# Altium schematic sheet moteus_n1.SchDoc
size 1051 x 725 mm; Origin: Eagle
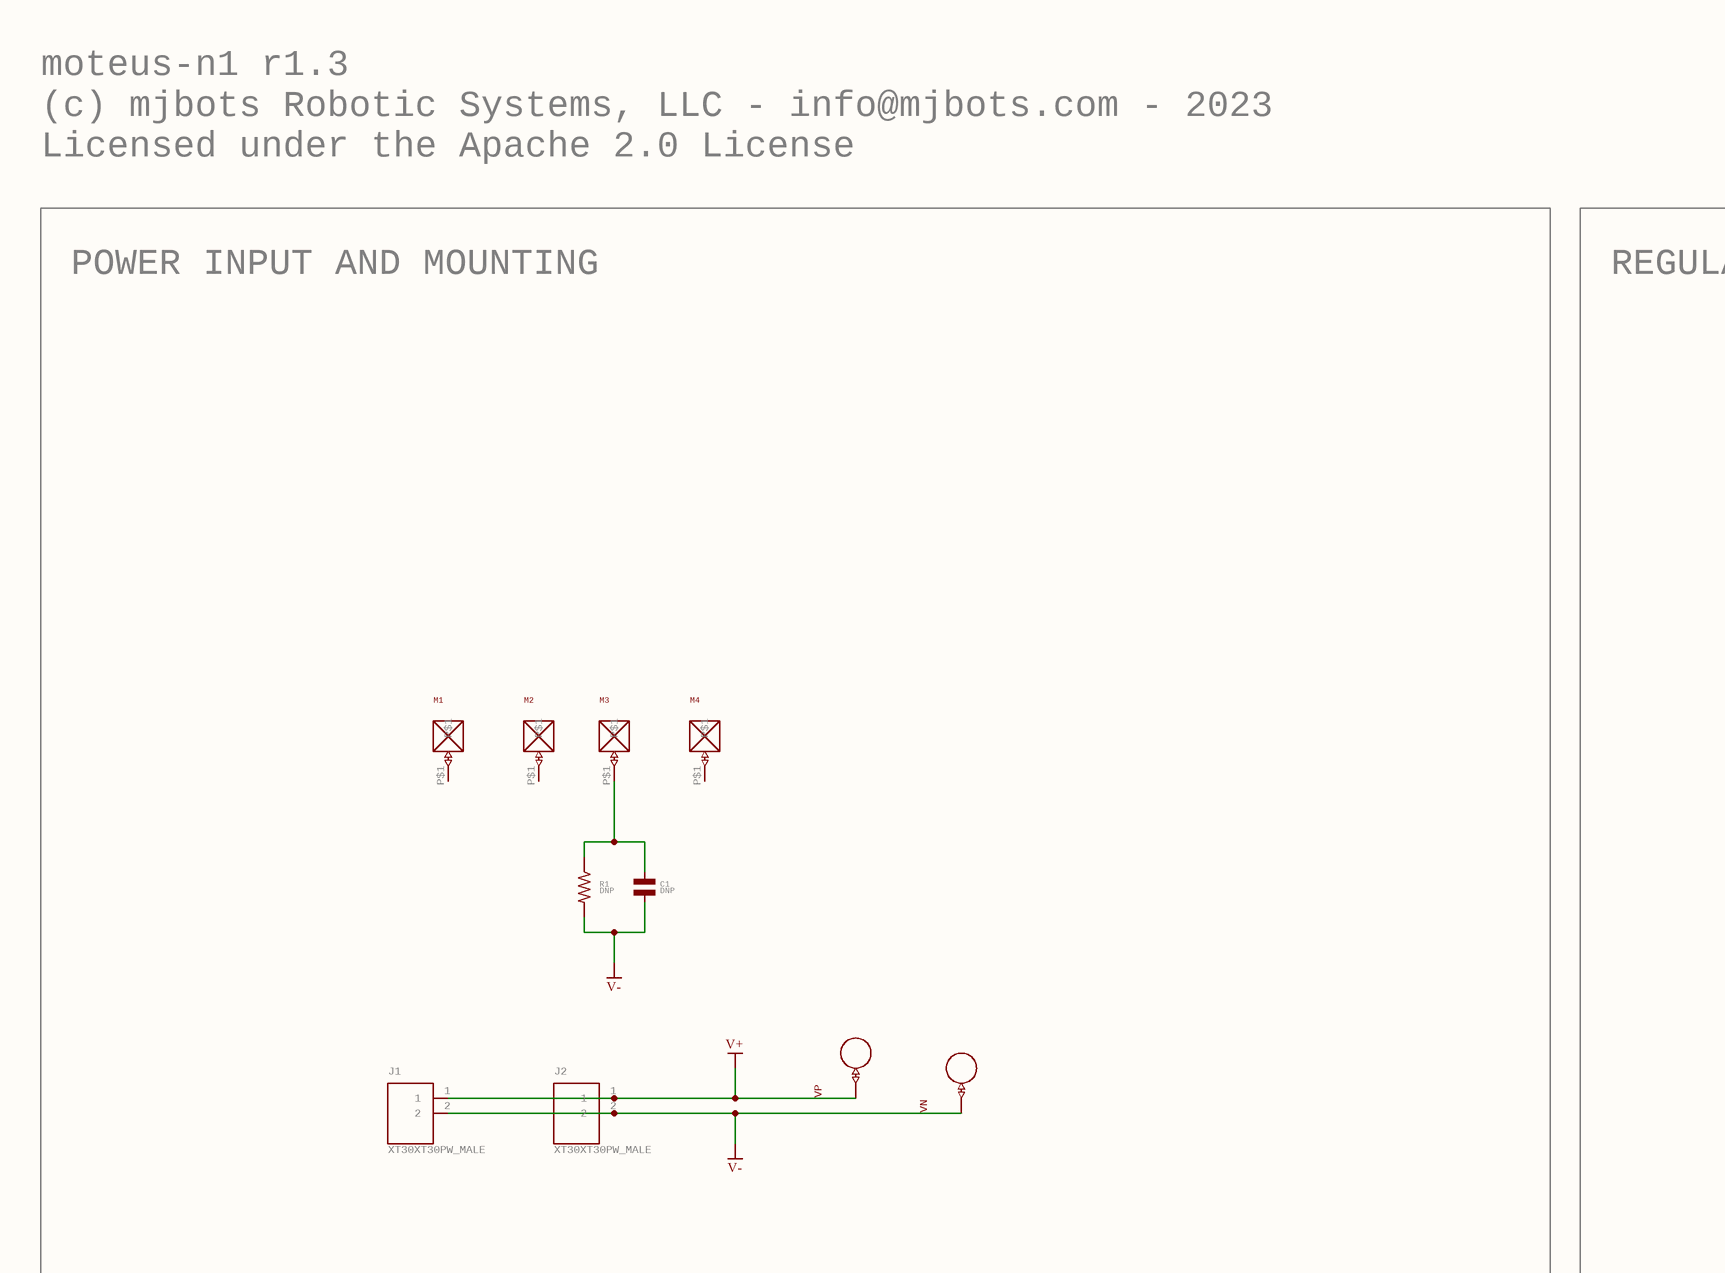
[diagram p0: moteus_n1.SchDoc, top column 1 of 4]
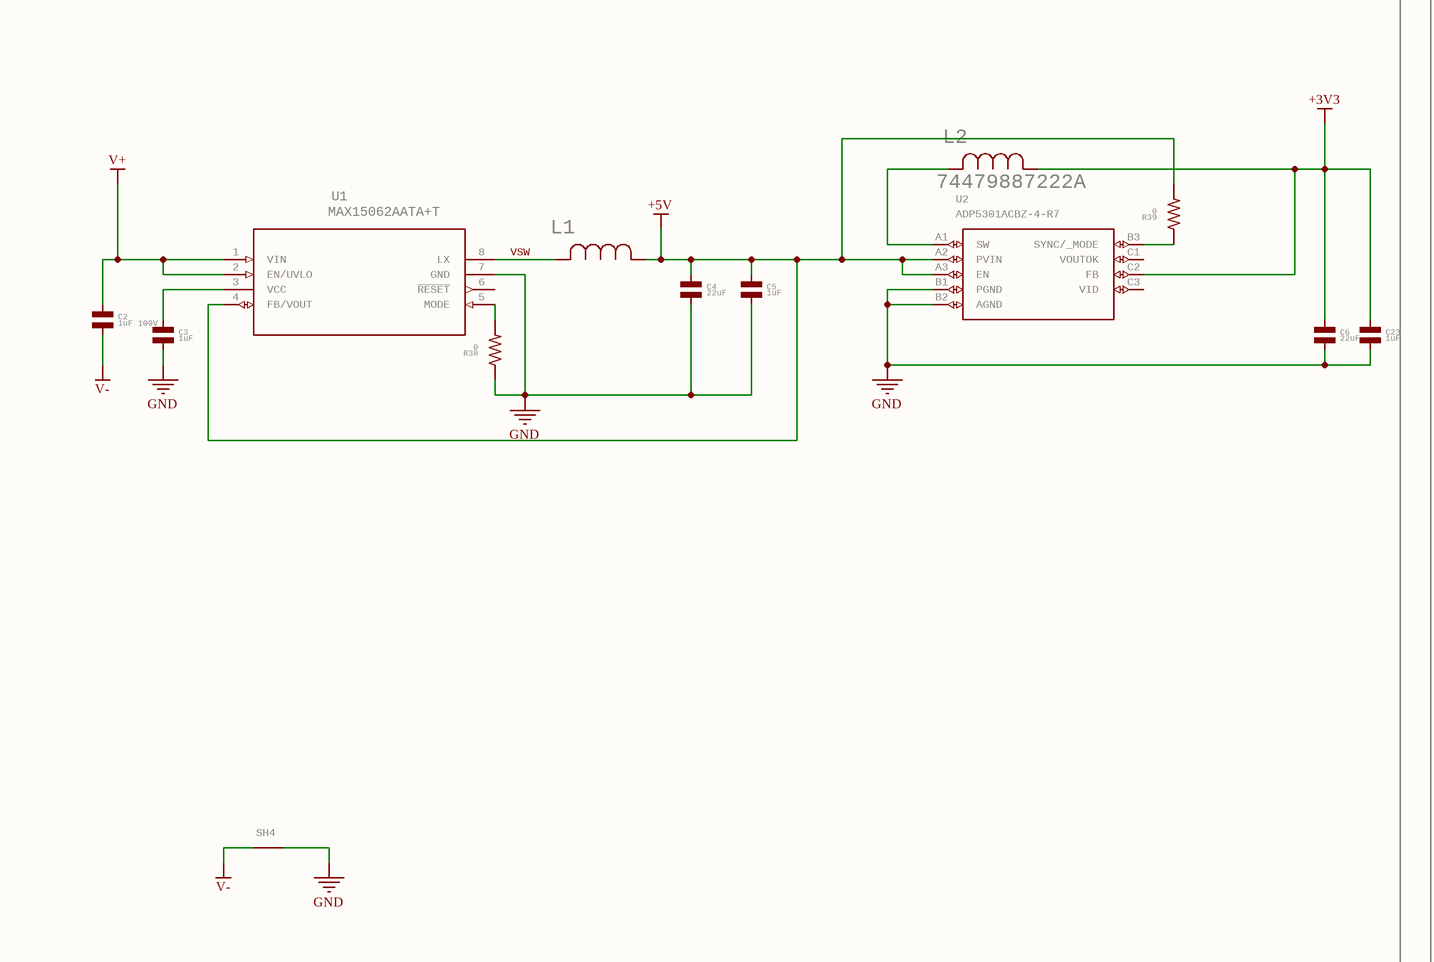
[diagram p1: moteus_n1.SchDoc, top column 2 of 4]
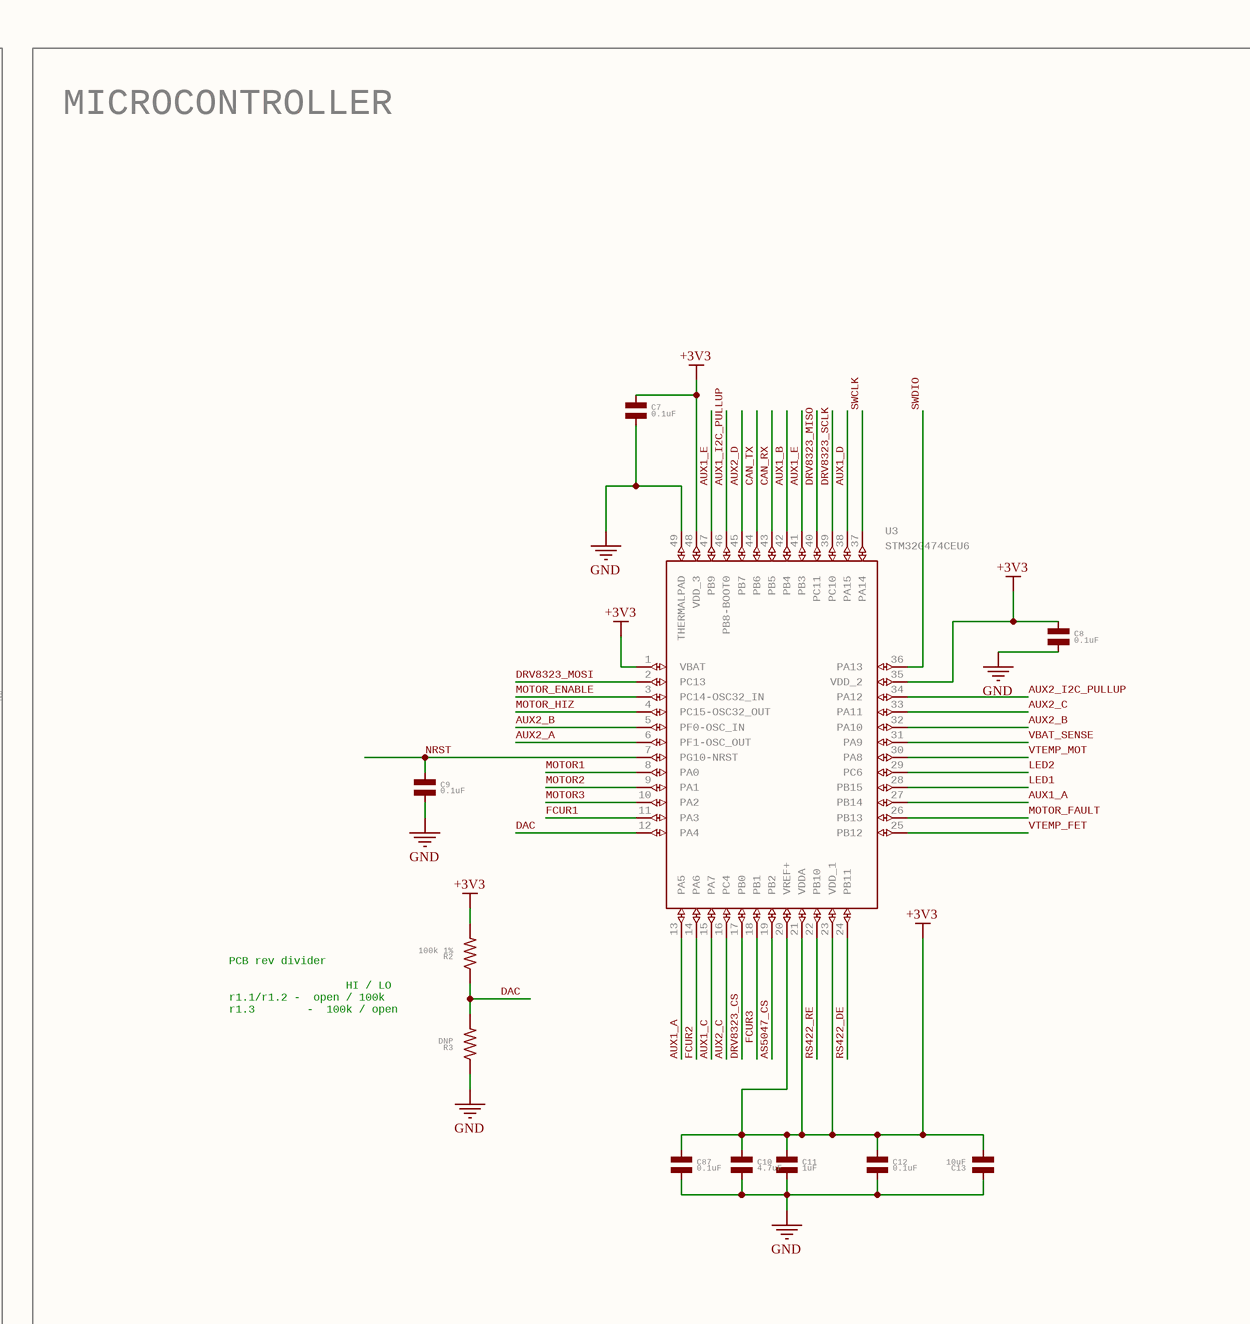
[diagram p2: moteus_n1.SchDoc, top column 3 of 4]
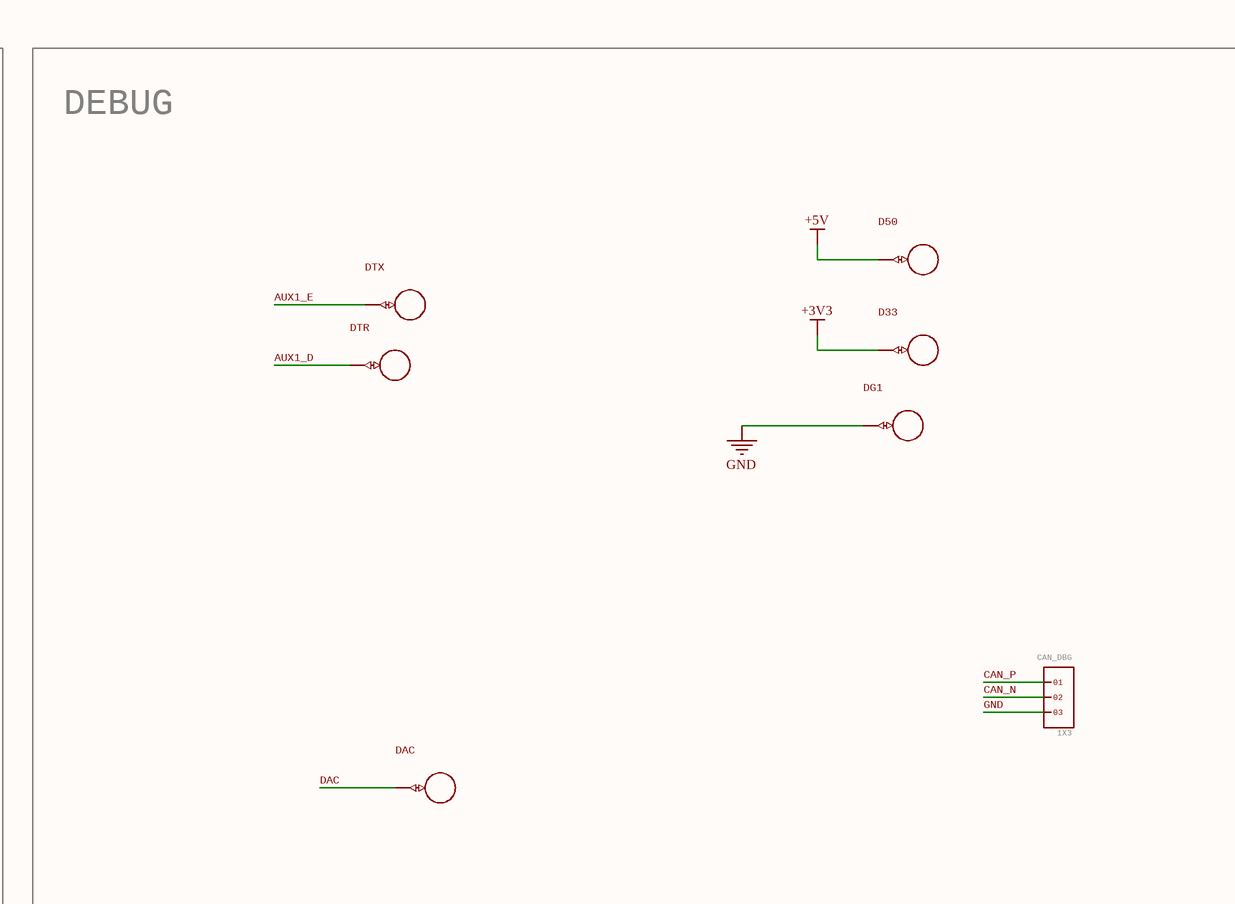
[diagram p3: moteus_n1.SchDoc, top column 4 of 4]
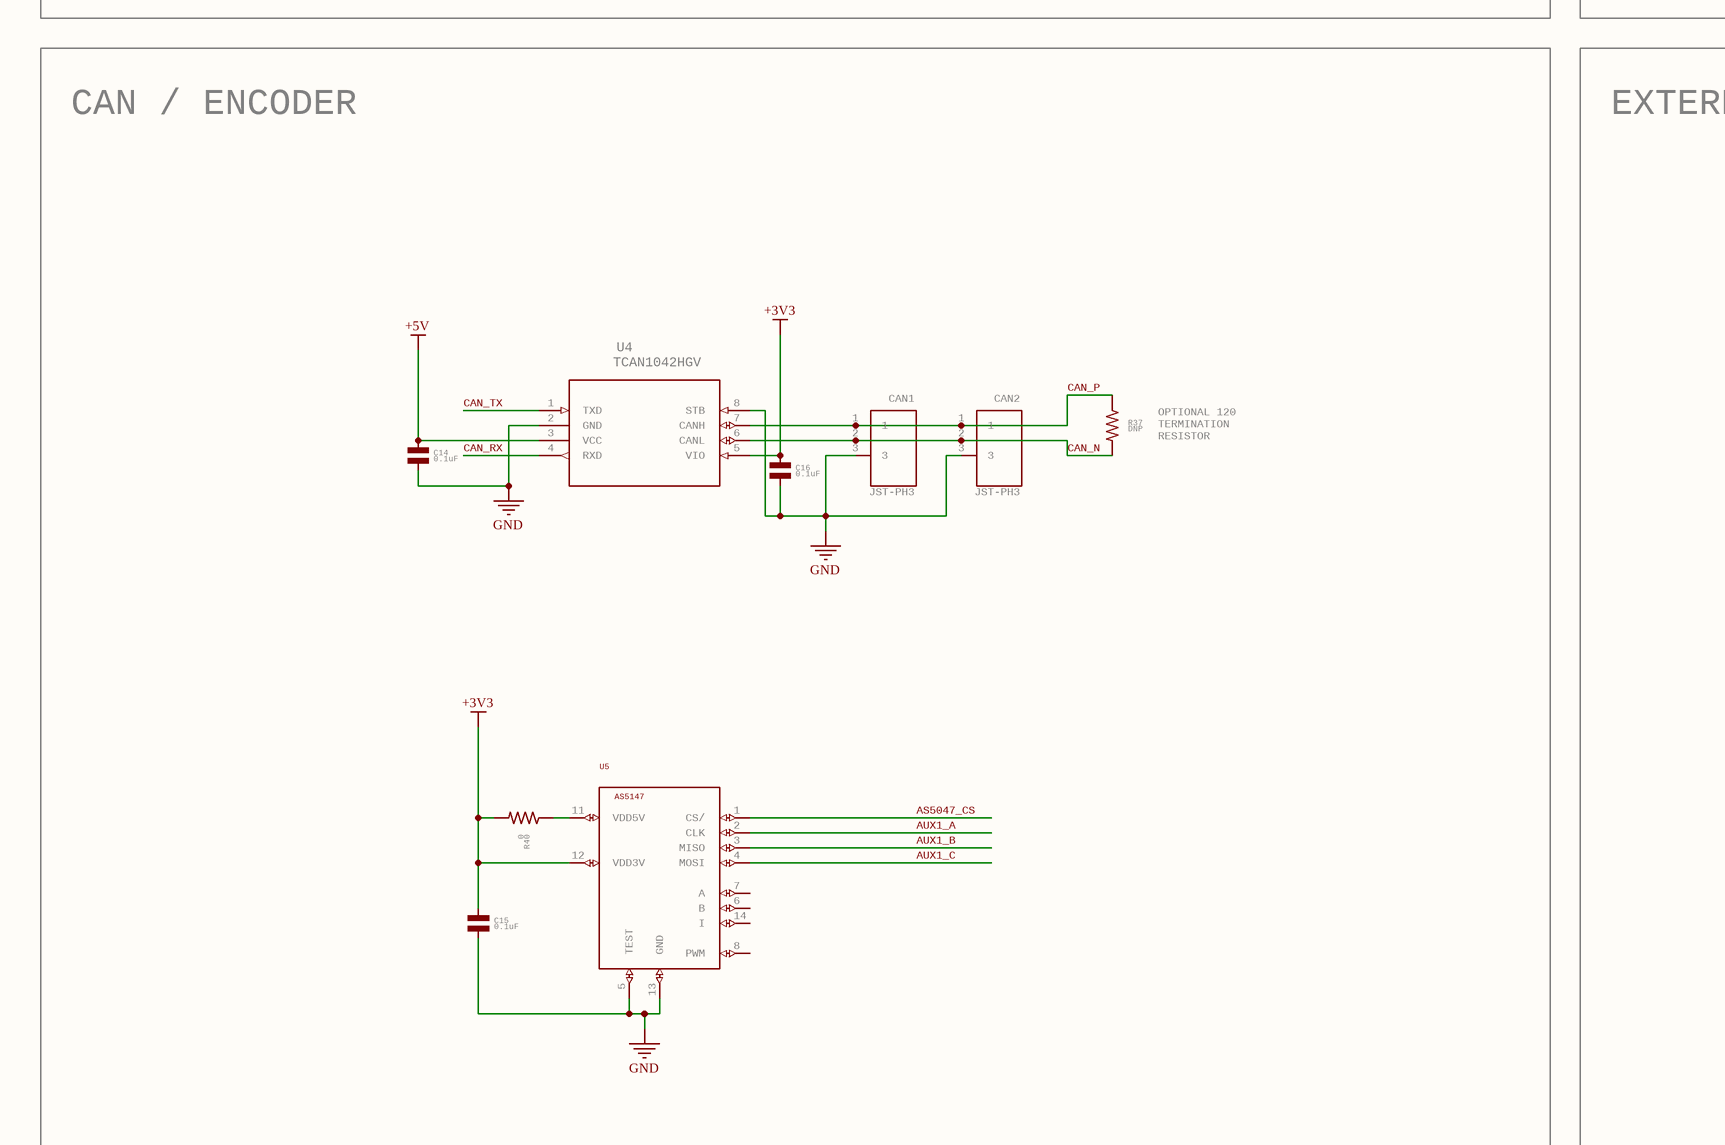
[diagram p4: moteus_n1.SchDoc, centre column 1 of 4]
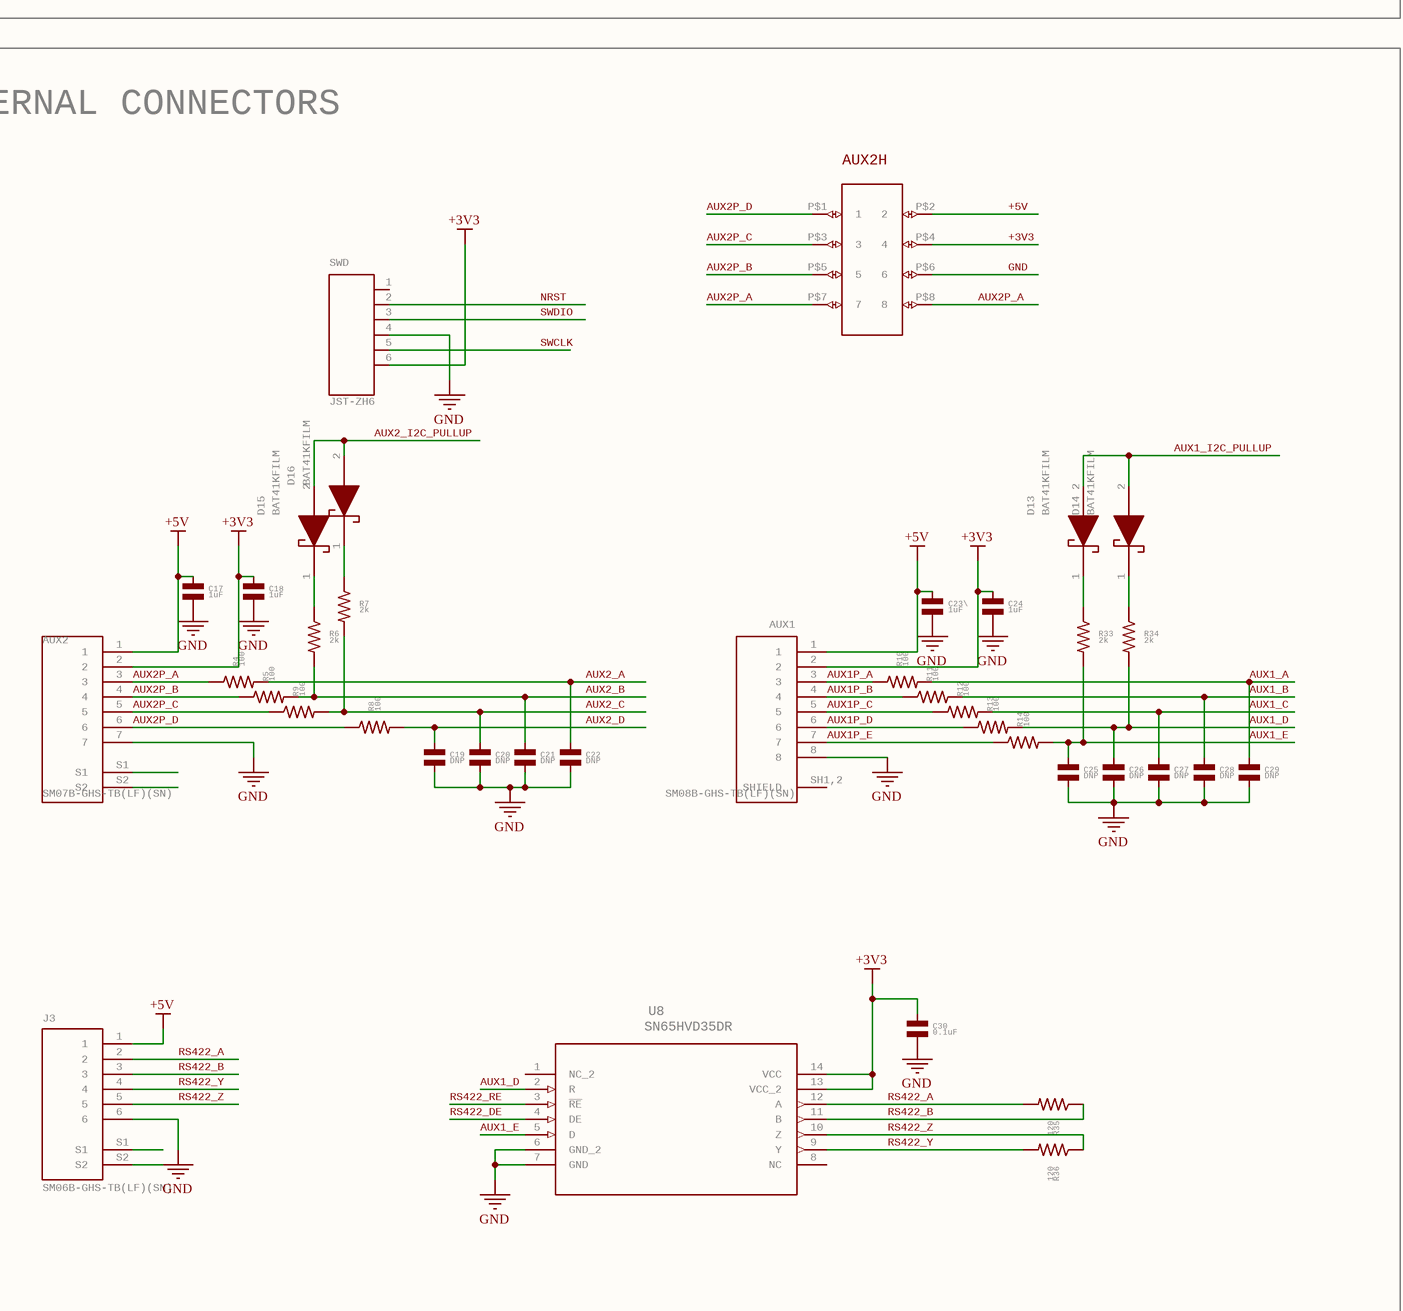
[diagram p5: moteus_n1.SchDoc, centre column 2 of 4]
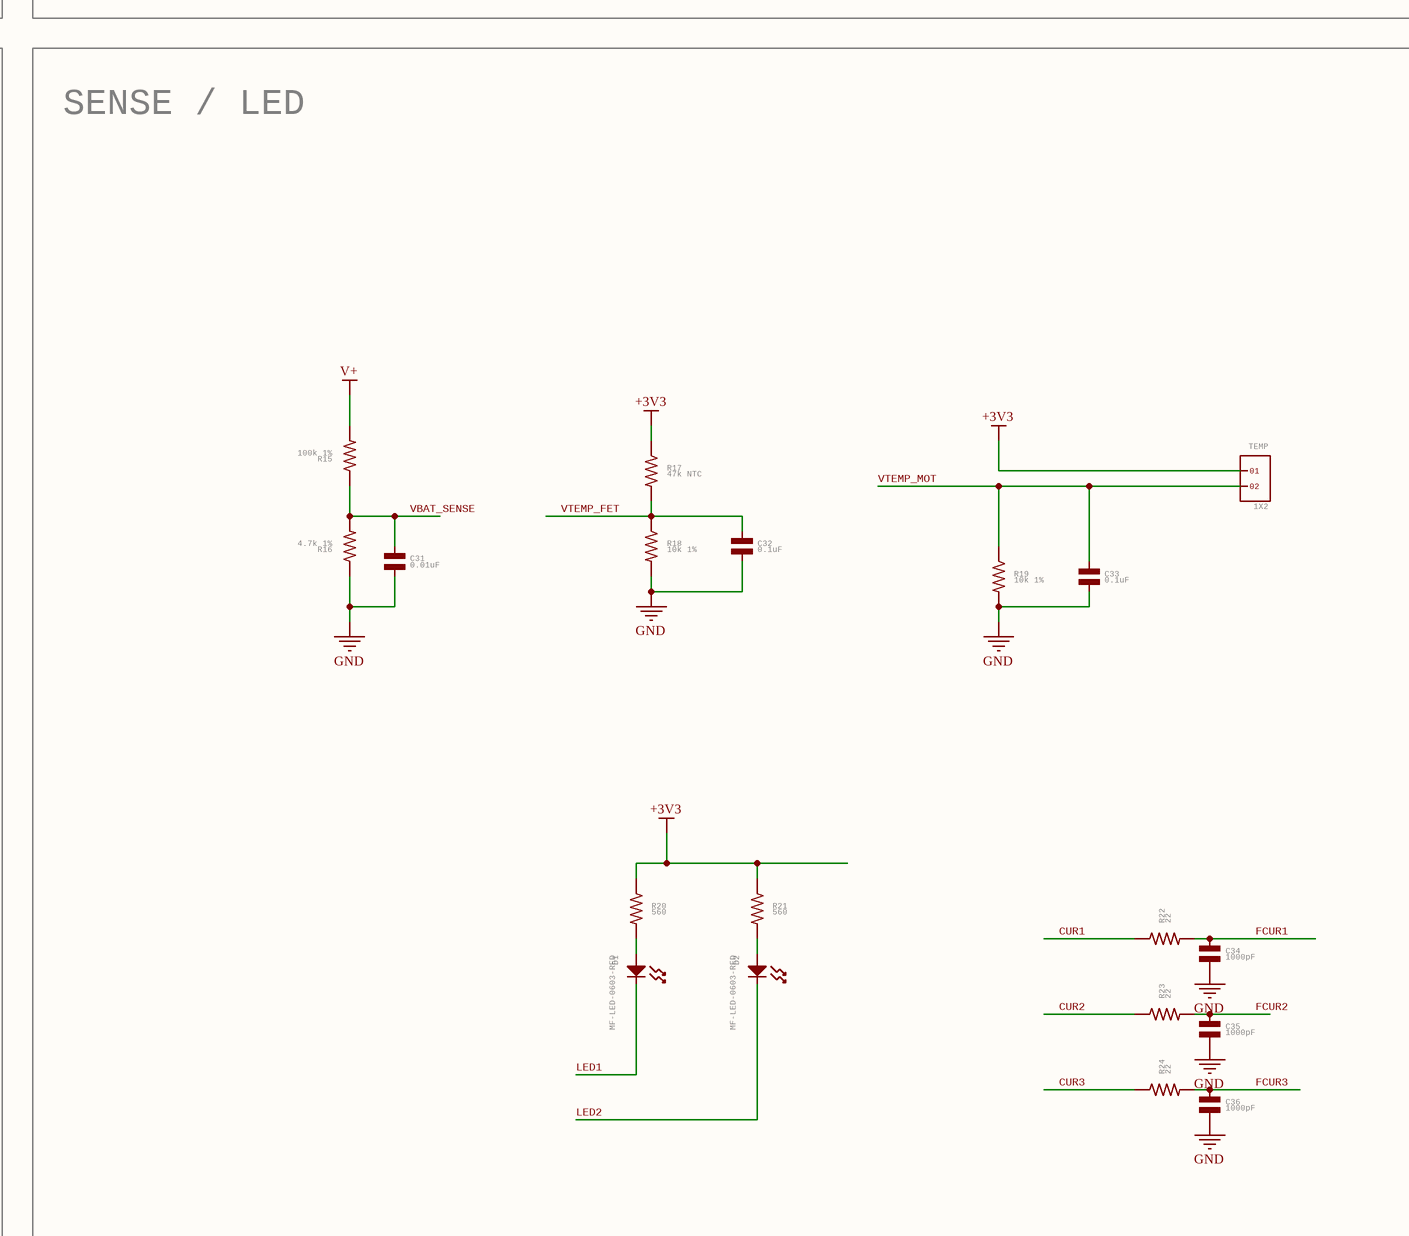
[diagram p6: moteus_n1.SchDoc, centre column 3 of 4]
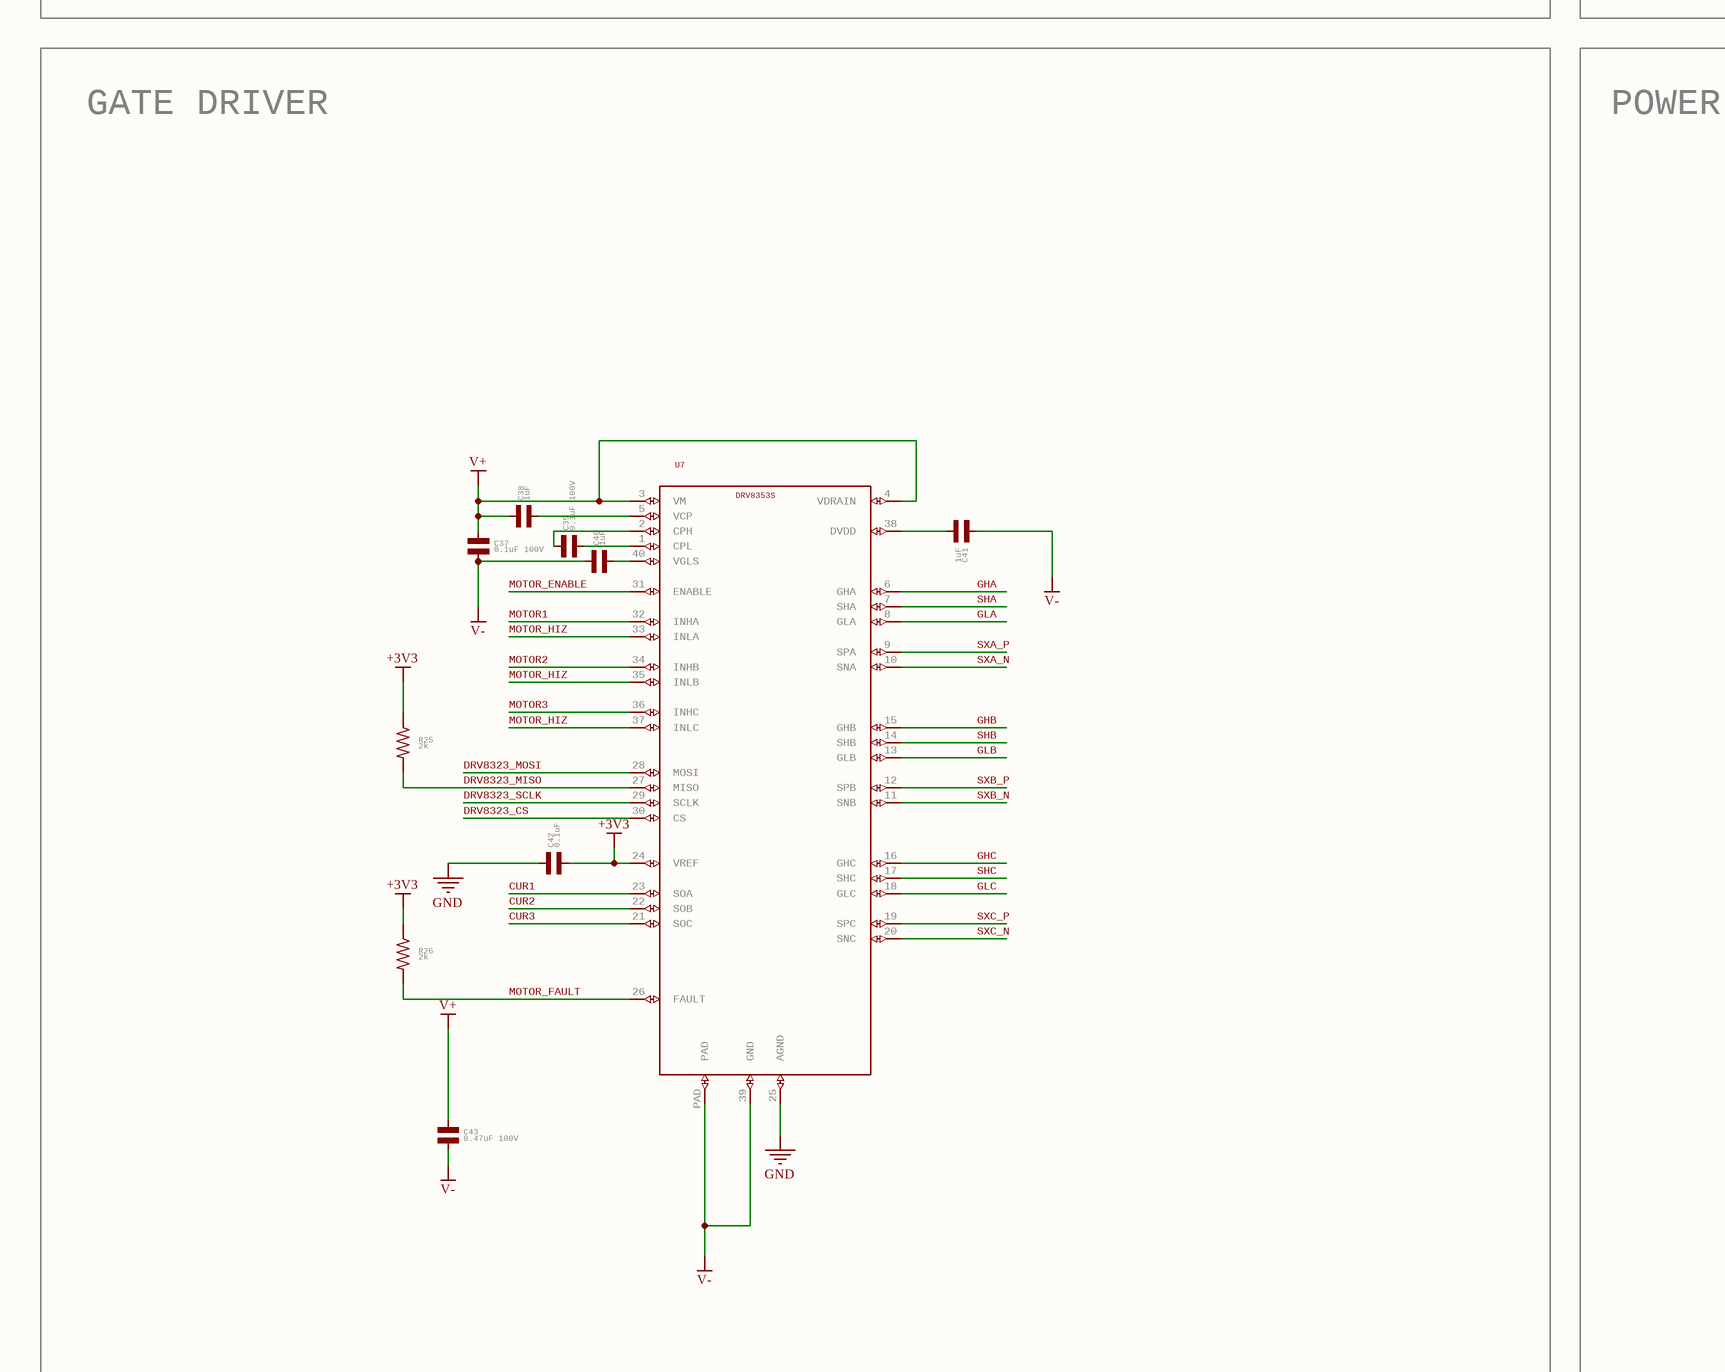
[diagram p7: moteus_n1.SchDoc, bottom column 1 of 4]
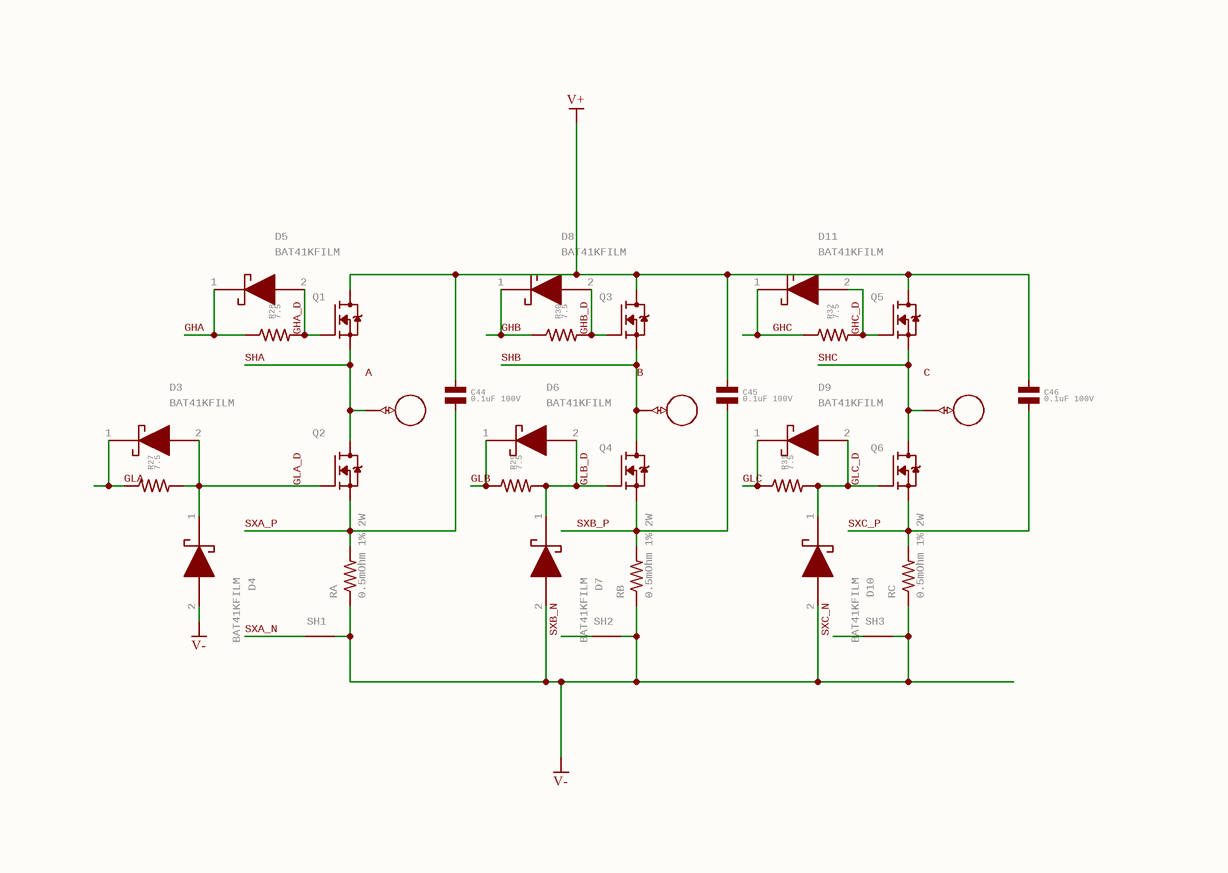
[diagram p8: moteus_n1.SchDoc, bottom column 2 of 4]
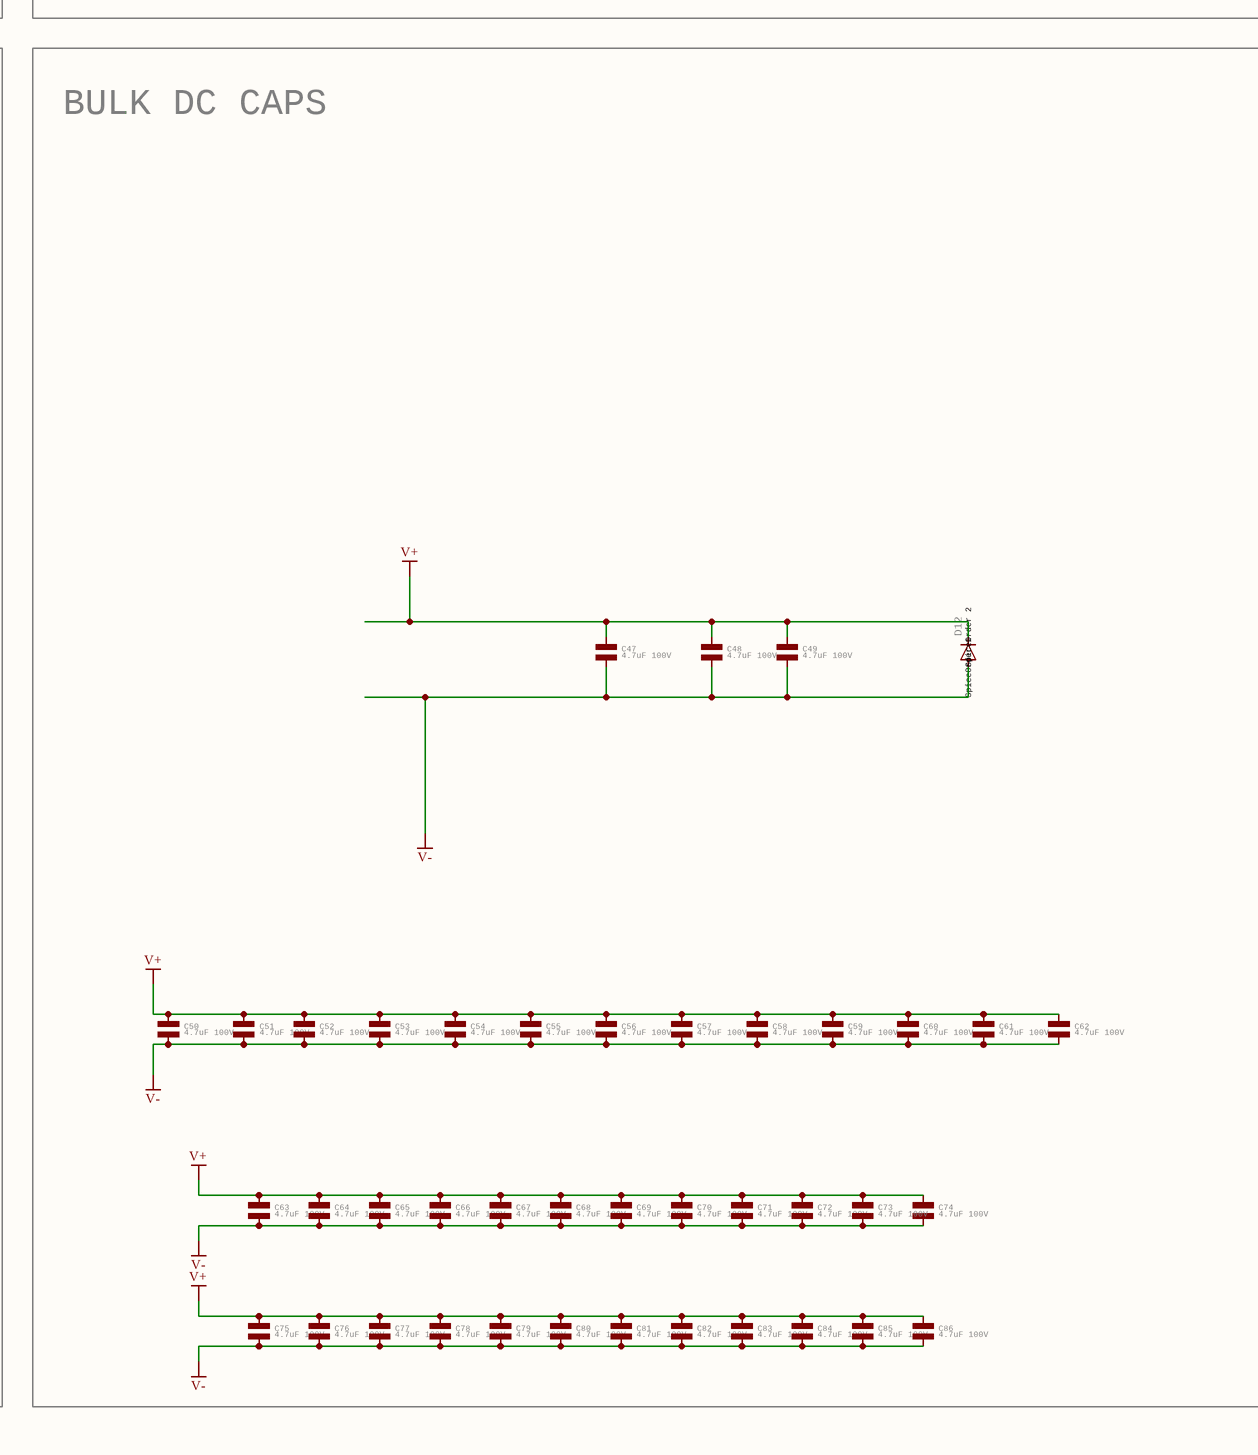
[diagram p9: moteus_n1.SchDoc, bottom column 3 of 4]

## Parts
A  PAD16AWG_TERM  [16AWG_TERM]  (value not drawn)
AUX1  SM08B-GHS-TB(LF)(SN)  [JST_SM08B-GHS-TB(LF)(SN)]
AUX2  SM07B-GHS-TB(LF)(SN)  [JST_SM07B-GHS-TB(LF)(SN)]
AUX2H  PH2X4  [PH2X4]  (value not drawn)
B  PAD16AWG_TERM  [16AWG_TERM]  (value not drawn)
C  PAD16AWG_TERM  [16AWG_TERM]  (value not drawn)
C1  DNP  [C0402]
C2  1uF 100V  [C0805]
C3  1uF  [C0603]
C4  22uF  [C1206]
C5  1uF  [C0402]
C6  22uF  [C1206]
C7  0.1uF  [C0402]
C8  0.1uF  [C0402]
C9  0.1uF  [C0402]
C10  4.7uF  [C0603]
C11  1uF  [C0402]
C12  0.1uF  [C0402]
C13  10uF  [C1206]
C14  0.1uF  [C0402]
C15  0.1uF  [C0402]
C16  0.1uF  [C0402]
C17  1uF  [C0603]
C18  1uF  [C0603]
C19  DNP  [C0402]
C20  DNP  [C0402]
C21  DNP  [C0402]
C22  DNP  [C0402]
C23  1uF  [C0402]
C23\  1uF  [C0603]
C24  1uF  [C0603]
C25  DNP  [C0402]
C26  DNP  [C0402]
C27  DNP  [C0402]
C28  DNP  [C0402]
C29  DNP  [C0402]
C30  0.1uF  [C0402]
C31  0.01uF  [C0402]
C32  0.1uF  [C0402]
C33  0.1uF  [C0402]
C34  1000pF  [C0402]
C35  1000pF  [C0402]
C36  1000pF  [C0402]
C37  0.1uF 100V  [C0603]
C38  1uF  [C0603]
C39  0.1uF 100V  [C0603]
C40  1uF  [C0603]
C41  1uF  [C0402]
C42  0.1uF  [C0402]
C43  0.47uF 100V  [C0805]
C44  0.1uF 100V  [C1206]
C45  0.1uF 100V  [C1206]
C46  0.1uF 100V  [C1206]
C47  4.7uF 100V  [C1206]
C48  4.7uF 100V  [C1206]
C49  4.7uF 100V  [C1206_NOBORDER]
C50  4.7uF 100V  [C1206_NOBORDER]
C51  4.7uF 100V  [C1206_NOBORDER]
C52  4.7uF 100V  [C1206_NOBORDER]
C53  4.7uF 100V  [C1206_NOBORDER]
C54  4.7uF 100V  [C1206_NOBORDER]
C55  4.7uF 100V  [C1206_NOBORDER]
C56  4.7uF 100V  [C1206_NOBORDER]
C57  4.7uF 100V  [C1206_NOBORDER]
C58  4.7uF 100V  [C1206_NOBORDER]
C59  4.7uF 100V  [C1206_NOBORDER]
C60  4.7uF 100V  [C1206_NOBORDER]
C61  4.7uF 100V  [C1206_NOBORDER]
C62  4.7uF 100V  [C1206_NOBORDER]
C63  4.7uF 100V  [C1206_NOBORDER]
C64  4.7uF 100V  [C1206_NOBORDER]
C65  4.7uF 100V  [C1206_NOBORDER]
C66  4.7uF 100V  [C1206_NOBORDER]
C67  4.7uF 100V  [C1206_NOBORDER]
C68  4.7uF 100V  [C1206_NOBORDER]
C69  4.7uF 100V  [C1206_NOBORDER]
C70  4.7uF 100V  [C1206_NOBORDER]
C71  4.7uF 100V  [C1206_NOBORDER]
C72  4.7uF 100V  [C1206_NOBORDER]
C73  4.7uF 100V  [C1206_NOBORDER]
C74  4.7uF 100V  [C1206_NOBORDER]
C75  4.7uF 100V  [C1206_NOBORDER]
C76  4.7uF 100V  [C1206_NOBORDER]
C77  4.7uF 100V  [C1206_NOBORDER]
C78  4.7uF 100V  [C1206_NOBORDER]
C79  4.7uF 100V  [C1206_NOBORDER]
C80  4.7uF 100V  [C1206_NOBORDER]
C81  4.7uF 100V  [C1206_NOBORDER]
C82  4.7uF 100V  [C1206_NOBORDER]
C83  4.7uF 100V  [C1206_NOBORDER]
C84  4.7uF 100V  [C1206_NOBORDER]
C85  4.7uF 100V  [C1206_NOBORDER]
C86  4.7uF 100V  [C1206_NOBORDER]
C87  0.1uF  [C0402]
CAN1  JST-PH3  [JST_S3B-PH-SM4-TB(LF)(SN)]
CAN2  JST-PH3  [JST_S3B-PH-SM4-TB(LF)(SN)]
CAN_DBG  1X3  [1X3]
D1  MF-LED-0603-RED  [LED0603]
D2  MF-LED-0603-RED  [LED0603]
D3  BAT41KFILM  [SODFL1608X70N]
D4  BAT41KFILM  [SODFL1608X70N]
D5  BAT41KFILM  [SODFL1608X70N]
D6  BAT41KFILM  [SODFL1608X70N]
D7  BAT41KFILM  [SODFL1608X70N]
D8  BAT41KFILM  [SODFL1608X70N]
D9  BAT41KFILM  [SODFL1608X70N]
D10  BAT41KFILM  [SODFL1608X70N]
D11  BAT41KFILM  [SODFL1608X70N]
D12  SpiceOrder1: SpiceOrder 1  SpiceOrder2: SpiceOrder 2  [DO214AA]  (hidden comment: DIODE-DO214AA)
D13  BAT41KFILM  [SODFL1608X70N]
D14  BAT41KFILM  [SODFL1608X70N]
D15  BAT41KFILM  [SODFL1608X70N]
D16  BAT41KFILM  [SODFL1608X70N]
D33  PAD24AWG_PAD  [24AWG_PAD]  (value not drawn)
D50  PAD24AWG_PAD  [24AWG_PAD]  (value not drawn)
DAC  PAD24AWG_PAD  [24AWG_PAD]  (value not drawn)
DG1  PAD24AWG_PAD  [24AWG_PAD]  (value not drawn)
DTR  PAD24AWG_PAD  [24AWG_PAD]  (value not drawn)
DTX  PAD24AWG_PAD  [24AWG_PAD]  (value not drawn)
J1  XT30XT30PW_MALE  [XT30PW_MALE]
J2  XT30XT30PW_MALE  [XT30PW_MALE]
J3  SM06B-GHS-TB(LF)(SN)  [JST_SM06B-GHS-TB(LF)(SN)]
L1  SRN4018-220M  [IND_BOURNS_SRN4018]  (value not drawn)
L2  74479887222A  [IND_1008_WE-PMI_WRE]
M1  MOUNT  [M2.5MOUNT]  (value not drawn)
M2  MOUNT  [M2.5MOUNT]  (value not drawn)
M3  MOUNT  [M2.5MOUNT]  (value not drawn)
M4  MOUNT  [M2.5MOUNT]  (value not drawn)
Q1  TPH1R204PL_VIAS  [SOP_ADVANCE_8_VIAS]  (value not drawn)
Q2  TPH1R204PLSOP_ADVANCE_8  [SOP_ADVANCE_8]  (value not drawn)
Q3  TPH1R204PL_VIAS  [SOP_ADVANCE_8_VIAS]  (value not drawn)
Q4  TPH1R204PLSOP_ADVANCE_8  [SOP_ADVANCE_8]  (value not drawn)
Q5  TPH1R204PL_VIAS  [SOP_ADVANCE_8_VIAS]  (value not drawn)
Q6  TPH1R204PLSOP_ADVANCE_8  [SOP_ADVANCE_8]  (value not drawn)
R1  DNP  [R0402]
R2  100k 1%  [R0402]
R3  DNP  [R0402]
R4  100  [R0402]
R5  100  [R0402]
R6  2k  [R0402]
R7  2k  [R0402]
R8  100  [R0402]
R9  100  [R0402]
R10  100  [R0402]
R11  100  [R0402]
R12  100  [R0402]
R13  100  [R0402]
R14  100  [R0402]
R15  100k 1%  [R0402]
R16  4.7k 1%  [R0402]
R17  47k NTC  [R0402]
R18  10k 1%  [R0402]
R19  10k 1%  [R0402]
R20  560  [R0402]
R21  560  [R0402]
R22  22  [R0402]
R23  22  [R0402]
R24  22  [R0402]
R25  2k  [R0402]
R26  2k  [R0402]
R27  7.5  [R0402]
R28  7.5  [R0402]
R29  7.5  [R0805]
R30  7.5  [R0402]
R31  7.5  [R0402]
R32  7.5  [R0402]
R33  2k  [R0402]
R34  2k  [R0402]
R35  120  [R0402]
R36  120  [R0402]
R37  DNP  [R0805]
R38  0  [R0402]
R39  0  [R0402]
R40  0  [R0402]
RA  0.5mOhm 1% 2W  [M1206]
RB  0.5mOhm 1% 2W  [M1206]
RC  0.5mOhm 1% 2W  [M1206]
SH1  SHORTT5  [SHORT_TOP-50]  (value not drawn)
SH2  SHORTT5  [SHORT_TOP-50]  (value not drawn)
SH3  SHORTT5  [SHORT_TOP-50]  (value not drawn)
SH4  SHORTMEDIUM  [SHORT_TOP-MEDIUM]  (value not drawn)
SWD  JST-ZH6  [JST_S6B-ZR-SM4A-TF(LF)(SN)]
TEMP  1X2  [1X2]
U1  MAX15062AATA+T  [21-0487A_MXM]
U2  ADP5301ACBZ-4-R7  [BGA9C50P3X3_165X187X66]
U3  STM32G474CEU6  [QFN50P700X700X60-49N]
U4  TCAN1042HGV  [SOIC8]
U5  AS5147  [TSSOP14]
U7  DRV8353S  [WQFN-40]
U8  SN65HVD35DR  [D14]
VN  PAD16AWG_TERM  [16AWG_TERM]  (value not drawn)
VP  PAD16AWG_TERM  [16AWG_TERM]  (value not drawn)

## Blocks framed on the sheet
POWER INPUT AND MOUNTING: C1 J1 J2 M1-M4 R1 VN VP
REGULATORS: C2-C6 C23 L1 L2 R38 R39 SH4 U1 U2
MICROCONTROLLER: C7-C13 C87 R2 R3 U3
DEBUG: CAN_DBG D33 D50 DAC DG1 DTR DTX
CAN / ENCODER: C14-C16 CAN1 CAN2 R37 R40 U4 U5
EXTERNAL CONNECTORS: AUX1 AUX2 AUX2H C17-C22 C23\ C24-C30 D13-D16 J3 R4-R14 R33-R36 SWD U8
SENSE / LED: C31-C36 D1 D2 R15-R24 TEMP
GATE DRIVER: C37-C43 R25 R26 U7
POWER STAGE: A B C C44-C46 D3-D11 Q1-Q6 R27-R32 RA RB RC SH1-SH3
BULK DC CAPS: C47-C86 D12

## Nets
+3V3: AUX1.2 AUX2.2 AUX2H.P$4(4) C6.P$1 C7.P$1 C8.P$1 C10.P$1 C11.P$1 C12.P$1 C13.P$2 C15.P$1 C16.P$1 C18.P$1 C23.P$1 C24.P$1 C30.P$1 C42.P$2 C87.P$1 D33.P$1 L2.1 R2.P$2 R17.P$1 R20.P$1 R21.P$1 R25.P$1 R26.P$1 R40.P$2 SWD.6 TEMP.1 U2.C2(FB) U3.1(VBAT) U3.20(VREF+) U3.21(VDDA) U3.23(VDD_1) U3.35(VDD_2) U3.48(VDD_3) U4.5(VIO) U5.12(VDD3V) U7.24(VREF) U8.13(VCC_2) U8.14(VCC)
+5V: AUX1.1 AUX2.1 AUX2H.P$2(2) C4.P$1 C5.P$1 C14.P$1 C17.P$1 C23\.P$1 D50.P$1 J3.1 L1.1 R39.P$2 U1.4(FB/VOUT) U2.A2(PVIN) U2.A3(EN) U4.3(VCC)
GND: AUX1.8 AUX2.7 AUX2H.P$6(6) C3.P$2 C4.P$2 C5.P$2 C6.P$2 C7.P$2 C8.P$2 C9.P$2 C10.P$2 C11.P$2 C12.P$2 C13.P$1 C14.P$2 C15.P$2 C16.P$2 C17.P$2 C18.P$2 C19.P$2 C20.P$2 C21.P$2 C22.P$2 C23.P$2 C23\.P$2 C24.P$2 C25.P$2 C26.P$2 C27.P$2 C28.P$2 C29.P$2 C30.P$2 C31.P$2 C32.P$2 C33.P$2 C34.P$2 C35.P$2 C36.P$2 C42.P$1 C87.P$2 CAN1.3 CAN2.3 CAN_DBG.3 DG1.P$1 J3.6 R3.P$1 R16.P$1 R18.P$2 R19.P$2 R38.P$1 SH4.2(P$2) SWD.4 U1.7(GND) U2.B1(PGND) U2.B2(AGND) U3.49(THERMALPAD) U4.2(GND) U4.8(STB) U5.5(TEST) U5.13(GND) U7.25(AGND) U8.6(GND_2) U8.7(GND)
V+: C2.P$1 C37.P$1 C38.P$1 C43.P$1 C44.P$1 C45.P$1 C46.P$1 C47.P$1 C48.P$1 C49.P$1 C50.P$1 C51.P$1 C52.P$1 C53.P$1 C54.P$1 C55.P$1 C56.P$1 C57.P$1 C58.P$1 C59.P$1 C60.P$1 C61.P$1 C62.P$1 C63.P$1 C64.P$1 C65.P$1 C66.P$1 C67.P$1 C68.P$1 C69.P$1 C70.P$1 C71.P$1 C72.P$1 C73.P$1 C74.P$1 C75.P$1 C76.P$1 C77.P$1 C78.P$1 C79.P$1 C80.P$1 C81.P$1 C82.P$1 C83.P$1 C84.P$1 C85.P$1 C86.P$1 D12.C J1.1 J2.1 Q1.5,6,7,8,PAD(D) Q3.5,6,7,8,PAD(D) Q5.5,6,7,8,PAD(D) R15.P$2 U1.1(VIN) U1.2(EN/UVLO) U7.3(VM) U7.4(VDRAIN) VP.1-13(P$1)
V-: C1.P$2 C2.P$2 C37.P$2 C40.P$1 C41.P$1 C43.P$2 C47.P$2 C48.P$2 C49.P$2 C50.P$2 C51.P$2 C52.P$2 C53.P$2 C54.P$2 C55.P$2 C56.P$2 C57.P$2 C58.P$2 C59.P$2 C60.P$2 C61.P$2 C62.P$2 C63.P$2 C64.P$2 C65.P$2 C66.P$2 C67.P$2 C68.P$2 C69.P$2 C70.P$2 C71.P$2 C72.P$2 C73.P$2 C74.P$2 C75.P$2 C76.P$2 C77.P$2 C78.P$2 C79.P$2 C80.P$2 C81.P$2 C82.P$2 C83.P$2 C84.P$2 C85.P$2 C86.P$2 D4.2(A) D7.2(A) D10.2(A) D12.A J1.2 J2.2 R1.P$2 RA.1 RB.1 RC.1 SH1.2(P$2) SH2.2(P$2) SH3.2(P$2) SH4.1(P$1) U7.39(GND) U7.PAD VN.1-13(P$1)
AS5047_CS: U3.19(PB2) U5.1(CS/)
AUX1_A: C25.P$1 C26.P$1 C27.P$1 C28.P$1 C29.P$1 DTR.P$1 DTX.P$1 R10.P$2 R11.P$2 R12.P$2 R13.P$2 R14.P$2 R33.P$2 R34.P$2 U3.13(PA5) U3.15(PA7) U3.27(PB14) U3.38(PA15) U3.41(PB3) U3.42(PB4) U3.47(PB9) U5.2(CLK) U5.3(MISO) U5.4(MOSI) U8.2(R) U8.5(D)  [also labelled AUX1_B, AUX1_C, AUX1_D, AUX1_E]
AUX1_I2C_PULLUP: D13.2(A) D14.2(A) U3.46(PB8-BOOT0)
AUX1P_A: AUX1.3 R10.P$1
AUX1P_B: AUX1.4 R11.P$1
AUX1P_C: AUX1.5 R12.P$1
AUX1P_D: AUX1.6 R13.P$1
AUX1P_E: AUX1.7 R14.P$1
AUX2_A: C22.P$1 R4.P$2 U3.6(PF1-OSC_OUT)
AUX2_B: C21.P$1 R5.P$2 R6.P$2 U3.5(PF0-OSC_IN) U3.32(PA10)
AUX2_C: C20.P$1 R7.P$2 R9.P$2 U3.16(PC4) U3.33(PA11)
AUX2_D: C19.P$1 R8.P$2 U3.45(PB7)
AUX2_I2C_PULLUP: D15.2(A) D16.2(A) U3.34(PA12)
AUX2P_A: AUX2.3 AUX2H.P$7(7) AUX2H.P$8(8) R4.P$1
AUX2P_B: AUX2.4 AUX2H.P$5(5) R5.P$1
AUX2P_C: AUX2.5 AUX2H.P$3(3) R9.P$1
AUX2P_D: AUX2.6 AUX2H.P$1(1) R8.P$1
CAN_N: CAN1.2 CAN2.2 CAN_DBG.2 R37.P$2 U4.6(CANL)
CAN_P: CAN1.1 CAN2.1 CAN_DBG.1 R37.P$1 U4.7(CANH)
CAN_RX: U3.43(PB5) U4.4(RXD)
CAN_TX: U3.44(PB6) U4.1(TXD)
CUR1: R22.P$1 U7.23(SOA)
CUR2: R23.P$1 U7.22(SOB)
CUR3: R24.P$1 U7.21(SOC)
DAC: DAC.P$1 R2.P$1 R3.P$2 U3.12(PA4)
DRV8323_CS: U3.17(PB0) U7.30(CS)
DRV8323_MISO: R25.P$2 U3.40(PC11) U7.27(MISO)
DRV8323_MOSI: U3.2(PC13) U7.28(MOSI)
DRV8323_SCLK: U3.39(PC10) U7.29(SCLK)
FCUR1: C34.P$1 R22.P$2 U3.11(PA3)
FCUR2: C35.P$1 R23.P$2 U3.14(PA6)
FCUR3: C36.P$1 R24.P$2 U3.18(PB1)
GHA: D5.1(K) R28.P$1 U7.6(GHA)
GHA_D: D5.2(A) Q1.4(G) R28.P$2
GHB: D8.1(K) R30.P$1 U7.15(GHB)
GHB_D: D8.2(A) Q3.4(G) R30.P$2
GHC: D11.1(K) R32.P$1 U7.16(GHC)
GHC_D: D11.2(A) Q5.4(G) R32.P$2
GLA: D3.1(K) R27.P$1 U7.8(GLA)
GLA_D: D3.2(A) D4.1(K) Q2.4(G) R27.P$2
GLB: D6.1(K) R29.P$1 U7.13(GLB)
GLB_D: D6.2(A) D7.1(K) Q4.4(G) R29.P$2
GLC: D9.1(K) R31.P$1 U7.18(GLC)
GLC_D: D9.2(A) D10.1(K) Q6.4(G) R31.P$2
LED1: D1.CATHODE U3.28(PB15)
LED2: D2.CATHODE U3.29(PC6)
MOTOR1: U3.8(PA0) U7.32(INHA)
MOTOR2: U3.9(PA1) U7.34(INHB)
MOTOR3: U3.10(PA2) U7.36(INHC)
MOTOR_ENABLE: U3.3(PC14-OSC32_IN) U7.31(ENABLE)
MOTOR_FAULT: R26.P$2 U3.26(PB13) U7.26(FAULT)
MOTOR_HIZ: U3.4(PC15-OSC32_OUT) U7.33(INLA) U7.35(INLB) U7.37(INLC)
NRST: C9.P$1 SWD.2 U3.7(PG10-NRST)
RS422_A: J3.2 R35.P$2 U8.12(A)
RS422_B: J3.3 R35.P$1 U8.11(B)
RS422_DE: U3.24(PB11) U8.4(DE)
RS422_RE: U3.22(PB10) U8.3(~{RE})
RS422_Y: J3.4 R36.P$2 U8.9(Y)
RS422_Z: J3.5 R36.P$1 U8.10(Z)
SHA: A.1-13(P$1) Q1.1-3(S) Q2.5,6,7,8,PAD(D) U7.7(SHA)
SHB: B.1-13(P$1) Q3.1-3(S) Q4.5,6,7,8,PAD(D) U7.14(SHB)
SHC: C.1-13(P$1) Q5.1-3(S) Q6.5,6,7,8,PAD(D) U7.17(SHC)
SWCLK: SWD.5 U3.37(PA14)
SWDIO: SWD.3 U3.36(PA13)
SXA_N: SH1.1(P$1) U7.10(SNA)
SXA_P: C44.P$2 Q2.1-3(S) RA.2 U7.9(SPA)
SXB_N: SH2.1(P$1) U7.11(SNB)
SXB_P: C45.P$2 Q4.1-3(S) RB.2 U7.12(SPB)
SXC_N: SH3.1(P$1) U7.20(SNC)
SXC_P: C46.P$2 Q6.1-3(S) RC.2 U7.19(SPC)
VBAT_SENSE: C31.P$1 R15.P$1 R16.P$2 U3.31(PA9)
VSW: L1.2 U1.8(LX)
VTEMP_FET: C32.P$1 R17.P$2 R18.P$1 U3.25(PB12)
VTEMP_MOT: C33.P$1 R19.P$1 TEMP.2 U3.30(PA8)
NetC1_P$1: C1.P$1 M3.P$1 R1.P$1
NetC3_P$1: C3.P$1 U1.3(VCC)
NetC38_P$2: C38.P$2 U7.5(VCP)
NetC39_P$1: C39.P$1 U7.2(CPH)
NetC39_P$2: C39.P$2 U7.1(CPL)
NetC40_P$2: C40.P$2 U7.40(VGLS)
NetC41_P$2: C41.P$2 U7.38(DVDD)
NetD1_ANODE: D1.ANODE R20.P$2
NetD2_ANODE: D2.ANODE R21.P$2
NetD13_1: D13.1(K) R33.P$1
NetD14_1: D14.1(K) R34.P$1
NetD15_1: D15.1(K) R6.P$1
NetD16_1: D16.1(K) R7.P$1
NetL2_2: L2.2 U2.A1(SW)
NetR38_P$2: R38.P$2 U1.5(MODE)
NetR39_P$1: R39.P$1 U2.B3(SYNC/_MODE)
NetR40_P$1: R40.P$1 U5.11(VDD5V)

Not connected (* = marked no-connect by the designer): AUX1 SH1,2(SHIELD); AUX2 S1 S2; J3 S1 S2; M1 P$1; M2 P$1; M4 P$1; SWD 1; U1 6(~{RESET}); U2 C1(VOUTOK) C3(VID); U5 6(B) 7(A) 8(PWM) 14(I); U8 1(NC_2) 8(NC)

## Notes on the sheet
- moteus-n1 r1.3
  (c) mjbots Robotic Systems, LLC - info@mjbots.com - 2023
  Licensed under the Apache 2.0 License
- PCB rev divider
  HI / LO
  r1.1/r1.2 -  open / 100k
  r1.3        -  100k / open
- (near R37) OPTIONAL 120
  TERMINATION
  RESISTOR

## Library data of the parts
A B C VN VP = PAD16AWG_TERM: GateName_1: G$1; SymbolName_1: PAD; POPULATE: 0; DeviceName: 16AWG_TERM; LibraryName: moteus_n1; DeviceSetName: PAD
AUX1 = SM08B-GHS-TB(LF)(SN): GH Series 8 Position 1.25 mm Pitch Side Entry Shrouded Header; GateName_1: G$1; DESCRIPTION: Connector Header Surface Mount, Right Angle 8 position 0.049 (1.25mm); MF: JST Sales; POPULATE: 1; SymbolName_1: SM08B-GHS-TB(LF)(SN); LibraryName: SM08B-GHS-TB_LF__SN_; DeviceSetName: SM08B-GHS-TB(LF)(SN); DIGI-KEY_PART_NUMBER: 455-1570-2-ND; MP: SM08B-GHS-TB(LF)(SN); MPN: SM08B-GHS-TB(LF)(SN); PACKAGE: None; PURCHASE-URL: https://pricing.snapeda.com/search/part/SM08B-GHS-TB(LF)(SN)/?ref=eda
AUX2 = SM07B-GHS-TB(LF)(SN): Conn Shrouded Header HDR 7 POS 1.25mm Solder RA SMD Reel; GateName_1: G$1; DESCRIPTION: Connector Header Surface Mount, Right Angle 7 position 0.049 (1.25mm); MF: JST Sales; POPULATE: 1; SymbolName_1: SM07B-GHS-TB(LF)(SN); LibraryName: SM07B-GHS-TB_LF__SN_; DeviceSetName: SM07B-GHS-TB(LF)(SN); DIGI-KEY_PART_NUMBER: 455-1569-2-ND; MP: SM07B-GHS-TB(LF)(SN); MPN: SM07B-GHS-TB(LF)(SN); PACKAGE: None; PURCHASE-URL: https://pricing.snapeda.com/search/part/SM07B-GHS-TB(LF)(SN)/?ref=eda
AUX2H = PH2X4: GateName_1: G$1; POPULATE: 0; SymbolName_1: PH2X4; LibraryName: moteus_n1; DeviceSetName: PH2X4
C1 C19-C22 C25-C29 = CAPACITOR_NP_0402: Library:  MF_Passives Description: Device for Non-Polarized Capacitors. Manufacture part number (MPN) can be added via Attributes. Check https://factory.macrofab.com/parts for the house parts list.; GateName_1: G$1; DeviceName: _0402; POPULATE: 0; SymbolName_1: CAPACITOR_NP; LibraryName: mfpassives; DeviceSetName: CAPACITOR_NP; DIELECTRIC: DIELECTRIC; HOUSEPART: HOUSEPART; MF: MF; MPN: MPN; TOLERANCE: TOLERANCE; URL: URL; VOLTAGE: VOLTAGE
C2 = CAPACITOR_NP_0805: Library:  MF_Passives Description: Device for Non-Polarized Capacitors. Manufacture part number (MPN) can be added via Attributes. Check https://factory.macrofab.com/parts for the house parts list.; MPN: GCM21BC72A105KE36L; GateName_1: G$1; DeviceName: _0805; MF: MURATA; POPULATE: 1; SymbolName_1: CAPACITOR_NP; LibraryName: mfpassives; DeviceSetName: CAPACITOR_NP; DIELECTRIC: DIELECTRIC; HOUSEPART: HOUSEPART; TOLERANCE: TOLERANCE; URL: URL; VOLTAGE: VOLTAGE
C3 C17 C18 C23\ C24 = CAPACITOR_NP_0603: Library:  MF_Passives Description: Device for Non-Polarized Capacitors. Manufacture part number (MPN) can be added via Attributes. Check https://factory.macrofab.com/parts for the house parts list.; HOUSEPART: 1; MPN: MF-CAP-0603-1uF; GateName_1: G$1; DeviceName: _0603; SymbolName_1: CAPACITOR_NP; LibraryName: mfpassives; DeviceSetName: CAPACITOR_NP; DIELECTRIC: DIELECTRIC; POPULATE: 1; TOLERANCE: TOLERANCE; URL: URL; VOLTAGE: VOLTAGE
C4 = CAPACITOR_NP_1206: Library:  MF_Passives Description: Device for Non-Polarized Capacitors. Manufacture part number (MPN) can be added via Attributes. Check https://factory.macrofab.com/parts for the house parts list.; HOUSEPART: 0; MPN: GRM31CR71A226KE15L; GateName_1: G$1; DeviceName: _1206; POPULATE: 1; SymbolName_1: CAPACITOR_NP; LibraryName: mfpassives; DeviceSetName: CAPACITOR_NP; DIELECTRIC: DIELECTRIC; MF: MF; TOLERANCE: TOLERANCE; URL: URL; VOLTAGE: VOLTAGE
C5 C11 C23 C41 = CAPACITOR_NP_0402: Library:  MF_Passives Description: Device for Non-Polarized Capacitors. Manufacture part number (MPN) can be added via Attributes. Check https://factory.macrofab.com/parts for the house parts list.; HOUSEPART: 1; MPN: MF-CAP-0402-1uF; GateName_1: G$1; DeviceName: _0402; SymbolName_1: CAPACITOR_NP; LibraryName: mfpassives; DeviceSetName: CAPACITOR_NP; DIELECTRIC: DIELECTRIC; MF: MF; POPULATE: 1; TOLERANCE: TOLERANCE; URL: URL; VOLTAGE: VOLTAGE
C6 = CAPACITOR_NP_1206: Library:  MF_Passives Description: Device for Non-Polarized Capacitors. Manufacture part number (MPN) can be added via Attributes. Check https://factory.macrofab.com/parts for the house parts list.; MPN: CL31B226KPHNNNE; GateName_1: G$1; DeviceName: _1206; MF: Samsung; POPULATE: 1; SymbolName_1: CAPACITOR_NP; LibraryName: mfpassives; DeviceSetName: CAPACITOR_NP; DIELECTRIC: DIELECTRIC; HOUSEPART: HOUSEPART; TOLERANCE: TOLERANCE; URL: URL; VOLTAGE: VOLTAGE
C7-C9 C12 C14-C16 C30 C32 C33 C42 C87 = CAPACITOR_NP_0402: Library:  MF_Passives Description: Device for Non-Polarized Capacitors. Manufacture part number (MPN) can be added via Attributes. Check https://factory.macrofab.com/parts for the house parts list.; HOUSEPART: 1; MPN: MF-CAP-0402-0.1uF; GateName_1: G$1; DeviceName: _0402; SymbolName_1: CAPACITOR_NP; LibraryName: mfpassives; DeviceSetName: CAPACITOR_NP; DIELECTRIC: DIELECTRIC; MF: MF; POPULATE: 1; TOLERANCE: TOLERANCE; URL: URL; VOLTAGE: VOLTAGE
C10 = CAPACITOR_NP_0603: Library:  MF_Passives Description: Device for Non-Polarized Capacitors. Manufacture part number (MPN) can be added via Attributes. Check https://factory.macrofab.com/parts for the house parts list.; HOUSEPART: 0; MPN: CL10A475KP8NNNC; GateName_1: G$1; DeviceName: _0603; POPULATE: 1; SymbolName_1: CAPACITOR_NP; LibraryName: mfpassives; DeviceSetName: CAPACITOR_NP; DIELECTRIC: DIELECTRIC; MF: MF; TOLERANCE: TOLERANCE; URL: URL; VOLTAGE: VOLTAGE
C13 = CAPACITOR_NP_1206: Library:  MF_Passives Description: Device for Non-Polarized Capacitors. Manufacture part number (MPN) can be added via Attributes. Check https://factory.macrofab.com/parts for the house parts list.; HOUSEPART: 1; MPN: MF-CAP-1206-10uF; GateName_1: G$1; DeviceName: _1206; SymbolName_1: CAPACITOR_NP; LibraryName: mfpassives; DeviceSetName: CAPACITOR_NP; DIELECTRIC: DIELECTRIC; POPULATE: 1; TOLERANCE: TOLERANCE; URL: URL; VOLTAGE: VOLTAGE
C31 = CAPACITOR_NP_0402: Library:  MF_Passives Description: Device for Non-Polarized Capacitors. Manufacture part number (MPN) can be added via Attributes. Check https://factory.macrofab.com/parts for the house parts list.; HOUSEPART: 1; MPN: MF-CAP-0402-0.01uF; GateName_1: G$1; DeviceName: _0402; SymbolName_1: CAPACITOR_NP; LibraryName: mfpassives; DeviceSetName: CAPACITOR_NP; DIELECTRIC: DIELECTRIC; MF: MF; POPULATE: 1; TOLERANCE: TOLERANCE; URL: URL; VOLTAGE: VOLTAGE
C34-C36 = CAPACITOR_NP_0402: Library:  MF_Passives Description: Device for Non-Polarized Capacitors. Manufacture part number (MPN) can be added via Attributes. Check https://factory.macrofab.com/parts for the house parts list.; HOUSEPART: 1; MPN: MF-CAP-0402-1nF; GateName_1: G$1; DeviceName: _0402; SymbolName_1: CAPACITOR_NP; LibraryName: mfpassives; DeviceSetName: CAPACITOR_NP; DIELECTRIC: DIELECTRIC; MF: MF; POPULATE: 1; TOLERANCE: TOLERANCE; URL: URL; VOLTAGE: VOLTAGE
C37 C39 = CAPACITOR_NP_0603: Library:  MF_Passives Description: Device for Non-Polarized Capacitors. Manufacture part number (MPN) can be added via Attributes. Check https://factory.macrofab.com/parts for the house parts list.; MPN: GCJ188R72A104KA01D; GateName_1: G$1; DeviceName: _0603; MF: MURATA; POPULATE: 1; SymbolName_1: CAPACITOR_NP; LibraryName: mfpassives; DeviceSetName: CAPACITOR_NP; DIELECTRIC: DIELECTRIC; HOUSEPART: HOUSEPART; TOLERANCE: TOLERANCE; URL: URL; VOLTAGE: VOLTAGE
C38 C40 = CAPACITOR_NP_0603: Library:  MF_Passives Description: Device for Non-Polarized Capacitors. Manufacture part number (MPN) can be added via Attributes. Check https://factory.macrofab.com/parts for the house parts list.; HOUSEPART: 0; MPN: C1608X7R1E105K080AE; GateName_1: G$1; DeviceName: _0603; MF: TDK; POPULATE: 1; SymbolName_1: CAPACITOR_NP; LibraryName: mfpassives; DeviceSetName: CAPACITOR_NP; DIELECTRIC: DIELECTRIC; TOLERANCE: TOLERANCE; URL: URL; VOLTAGE: VOLTAGE
C43 = CAPACITOR_NP_0805: Library:  MF_Passives Description: Device for Non-Polarized Capacitors. Manufacture part number (MPN) can be added via Attributes. Check https://factory.macrofab.com/parts for the house parts list.; MPN: 08051C474KAT2A; GateName_1: G$1; DeviceName: _0805; MF: KYOCERA; POPULATE: 1; SymbolName_1: CAPACITOR_NP; LibraryName: mfpassives; DeviceSetName: CAPACITOR_NP; DIELECTRIC: DIELECTRIC; HOUSEPART: HOUSEPART; TOLERANCE: TOLERANCE; URL: URL; VOLTAGE: VOLTAGE
C44-C46 = CAPACITOR_NP_1206: Library:  MF_Passives Description: Device for Non-Polarized Capacitors. Manufacture part number (MPN) can be added via Attributes. Check https://factory.macrofab.com/parts for the house parts list.; MPN: 12061C104KAT2A; GateName_1: G$1; DeviceName: _1206; MF: KYOCERA AVX; POPULATE: 1; SymbolName_1: CAPACITOR_NP; LibraryName: mfpassives; DeviceSetName: CAPACITOR_NP; DIELECTRIC: DIELECTRIC; HOUSEPART: HOUSEPART; TOLERANCE: TOLERANCE; URL: URL; VOLTAGE: VOLTAGE
C47 C48 = CAPACITOR_NP_1206: Library:  MF_Passives Description: Device for Non-Polarized Capacitors. Manufacture part number (MPN) can be added via Attributes. Check https://factory.macrofab.com/parts for the house parts list.; MPN: GRJ31CC72A475KE01K; GateName_1: G$1; DeviceName: _1206; MF: MURATA; POPULATE: 1; SymbolName_1: CAPACITOR_NP; LibraryName: mfpassives; DeviceSetName: CAPACITOR_NP; DIELECTRIC: DIELECTRIC; HOUSEPART: HOUSEPART; TOLERANCE: TOLERANCE; URL: URL; VOLTAGE: VOLTAGE
C49-C86 = CAPACITOR_NP_NOBORDER: MPN: GRJ31CC72A475KE01K; GateName_1: A; MF: MURATA; POPULATE: 1; SymbolName_1: CAPACITOR_NP; DeviceName: _NOBORDER; LibraryName: moteus_hp; DeviceSetName: CAPACITOR_NP
  C49: DIELECTRIC: DIELECTRIC; HOUSEPART: HOUSEPART; TOLERANCE: TOLERANCE; URL: URL; VOLTAGE: VOLTAGE
CAN1 = JST-PH3: MPN: S3B-PH-SM4-TB(LF)(SN); GateName_1: A; SymbolName_1: CON03; MF: JST; POPULATE: 1; LibraryName: moteus_n1; DeviceSetName: JST-PH3
CAN2 = JST-PH3: MPN: S3B-PH-SM4-TB(LF)(SN); GateName_1: A; SymbolName_1: CON03; MF: JST; POPULATE: 0; LibraryName: moteus_n1; DeviceSetName: JST-PH3
CAN_DBG = 1X3: GateName_1: G$1; SymbolName_1: 1X3_HEADER; POPULATE: 0; LibraryName: headers_2mm; DeviceSetName: 1X3; 01: 01; 02: 02; 03: 03
D1 = LED_SINGLE-0603-RED: Library:  MF_LEDs Description: Device for Single LED Packages. Manufacture part number (MFG#) can be added via Attributes.; HOUSEPART: 1; GateName_1: G$1; SymbolName_1: LED; DeviceName: -0603-RED; LibraryName: mfleds; DeviceSetName: LED_SINGLE; MPN: MF-LED-0603-RED; POPULATE: 1; URL: https://factory.macrofab.com/part/MF-LED-0603-RED
D2 = LED_SINGLE-0603-RED: Library:  MF_LEDs Description: Device for Single LED Packages. Manufacture part number (MFG#) can be added via Attributes.; HOUSEPART: 1; MPN: MF-LED-0603-GREEN; GateName_1: G$1; SymbolName_1: LED; DeviceName: -0603-RED; LibraryName: mfleds; DeviceSetName: LED_SINGLE; POPULATE: 1; URL: https://factory.macrofab.com/part/MF-LED-0603-RED
D3-D11 D13-D16 = BAT41KFILM: STMicroelectronics 100V 200mA, Diode, 2-Pin SOD-523 BAT41KFILM   Source:  Datasheet; GateName_1: G$1; MF: ST; POPULATE: 1; SymbolName_1: BAT41KFILM; LibraryName: BAT41KFILM; DeviceSetName: BAT41KFILM; DESCRIPTION: STMicroelectronics 100V 200mA, Diode, 2-Pin SOD-523 BAT41KFILM; HEIGHT: 0.7mm; MANUFACTURER_NAME: STMicroelectronics; MANUFACTURER_PART_NUMBER: BAT41KFILM; MOUSER_PART_NUMBER: 511-BAT41KFILM; MOUSER_PRICE-STOCK: https://www.mouser.co.uk/ProductDetail/STMicroelectronics/BAT41KFILM?qs=jZi1jxfVU94ZzsUNeiIqGg%3D%3D; MPN: BAT41KFILM
D12 = DIODE-DO214AA: DIODE; MPN: SMBJ51D-M3/I; GateName_1: G$1; SymbolName_1: D; DeviceSetName: DIODE-; MF: VISHAY; POPULARITY: 8; POPULATE: 1; DeviceName: DO214AA; LibraryName: diode
D33 D50 DAC DG1 DTR DTX = PAD24AWG_PAD: GateName_1: G$1; SymbolName_1: PAD; POPULATE: 0; DeviceName: 24AWG_PAD; LibraryName: controller; DeviceSetName: PAD
J1 = XT30XT30PW_MALE: MPN: XT30PW-M; GateName_1: G$1; SymbolName_1: CON02; DeviceSetName: XT30; POPULATE: 1; DeviceName: XT30PW_MALE; LibraryName: moteus_n1
J2 = XT30XT30PW_MALE: MPN: XT30PW-M; GateName_1: G$1; SymbolName_1: CON02; DeviceSetName: XT30; POPULATE: 0; DeviceName: XT30PW_MALE; LibraryName: moteus_n1
J3 = SM06B-GHS-TB(LF)(SN): Conn Shrouded Header HDR 7 POS 1.25mm Solder RA SMD Reel; GateName_1: G$1; DESCRIPTION: Connector Header Surface Mount, Right Angle 7 position 0.049 (1.25mm); MF: JST Sales; POPULATE: 1; SymbolName_1: SM06B-GHS-TB(LF)(SN); LibraryName: SM06B-GHS-TB_LF__SN_; DeviceSetName: SM06B-GHS-TB(LF)(SN); DIGI-KEY_PART_NUMBER: DIGI-KEY_PART_NUMBER; MP: SM06B-GHS-TB(LF)(SN); MPN: SM06B-GHS-TB(LF)(SN); PACKAGE: None; PURCHASE-URL: PURCHASE-URL
L1 = SRN4018-220M: MANUFACTURER_PART_NUMBER: 74404042470; GateName_1: A; SymbolName_1: IND; MF: Wurth Electronics; POPULATE: 1; VENDOR: Wurth; LibraryName: controller; DeviceSetName: SRN4018-220M; MPN: 74404042470
L2 = 74479887222A: MFR_NAME: Wurth Electronics; GateName_1: A; SymbolName_1: IND; MF: WURTH; LibraryName: moteus_n1; DeviceSetName: 74479887222A; COPYRIGHT: Copyright (C) 2023 Ultra Librarian. All rights reserved.; DIGI-KEY_PART_NUMBER_1: 732-4513-2-ND; DIGI-KEY_PART_NUMBER_2: 732-4513-1-ND; DIGI-KEY_PART_NUMBER_3: 732-4513-6-ND; MANUFACTURER_PART_NUMBER: 74479887222A; MPN: 74479887222A
M1-M4 = MOUNT: GateName_1: G$1; POPULATE: 0; SymbolName_1: MOUNT; LibraryName: controller; DeviceSetName: MOUNT
Q1 Q3 Q5 = TPH1R204PL_VIAS: MPN: TPH2R408QM,L1Q; GateName_1: G$1; SymbolName_1: N-MOSFET; DeviceName: _VIAS; MF: Toshiba; POPULATE: 1; LibraryName: moteus_n1; DeviceSetName: TPH1R204PL
Q2 Q4 Q6 = TPH1R204PLSOP_ADVANCE_8: MPN: TPH2R408QM,L1Q; GateName_1: G$1; SymbolName_1: N-MOSFET; MF: Toshiba; POPULATE: 1; DeviceName: SOP_ADVANCE_8; LibraryName: moteus_n1; DeviceSetName: TPH1R204PL
R1 R3 = RESISTOR_0402: Library:  MF_Passives Description: Device for Resistors. Manufacture part number (MPN), Voltage, Tolerance, and Wattage Rating can be added via Attributes.  Check https://factory.macrofab.com/parts for the house parts list.; GateName_1: G$1; DeviceName: _0402; POPULATE: 0; SymbolName_1: RESISTOR; LibraryName: mfpassives; DeviceSetName: RESISTOR; HOUSEPART: HOUSEPART; MPN: MPN; TOLERANCE: TOLERANCE; URL: URL; VOLTAGE: VOLTAGE; WATTAGE: WATTAGE
  R3: MF: MF
R2 R15 = RESISTOR_0402: Library:  MF_Passives Description: Device for Resistors. Manufacture part number (MPN), Voltage, Tolerance, and Wattage Rating can be added via Attributes.  Check https://factory.macrofab.com/parts for the house parts list.; MPN: RC0402FR-07100KL; GateName_1: G$1; DeviceName: _0402; MF: Yageo; POPULATE: 1; SymbolName_1: RESISTOR; LibraryName: mfpassives; DeviceSetName: RESISTOR; HOUSEPART: HOUSEPART; TOLERANCE: TOLERANCE; URL: URL; VOLTAGE: VOLTAGE; WATTAGE: WATTAGE
R4 R5 R8-R14 = RESISTOR_0402: Library:  MF_Passives Description: Device for Resistors. Manufacture part number (MPN), Voltage, Tolerance, and Wattage Rating can be added via Attributes.  Check https://factory.macrofab.com/parts for the house parts list.; HOUSEPART: 1; MPN: MF-RES-0402-100; GateName_1: G$1; DeviceName: _0402; SymbolName_1: RESISTOR; LibraryName: mfpassives; DeviceSetName: RESISTOR; POPULATE: 1; TOLERANCE: TOLERANCE; URL: URL; VOLTAGE: VOLTAGE; WATTAGE: WATTAGE
R6 R7 R25 R26 R33 R34 = RESISTOR_0402: Library:  MF_Passives Description: Device for Resistors. Manufacture part number (MPN), Voltage, Tolerance, and Wattage Rating can be added via Attributes.  Check https://factory.macrofab.com/parts for the house parts list.; HOUSEPART: 1; MPN: MF-RES-0402-2K; GateName_1: G$1; DeviceName: _0402; SymbolName_1: RESISTOR; LibraryName: mfpassives; DeviceSetName: RESISTOR; MF: MF; POPULATE: 1; TOLERANCE: TOLERANCE; URL: URL; VOLTAGE: VOLTAGE; WATTAGE: WATTAGE
R16 = RESISTOR_0402: Library:  MF_Passives Description: Device for Resistors. Manufacture part number (MPN), Voltage, Tolerance, and Wattage Rating can be added via Attributes.  Check https://factory.macrofab.com/parts for the house parts list.; MPN: RC0402FR-074K7L; GateName_1: G$1; DeviceName: _0402; MF: Yageo; POPULATE: 1; SymbolName_1: RESISTOR; LibraryName: mfpassives; DeviceSetName: RESISTOR; HOUSEPART: HOUSEPART; TOLERANCE: TOLERANCE; URL: URL; VOLTAGE: VOLTAGE; WATTAGE: WATTAGE
R17 = RESISTOR_0402: Library:  MF_Passives Description: Device for Resistors. Manufacture part number (MPN), Voltage, Tolerance, and Wattage Rating can be added via Attributes.  Check https://factory.macrofab.com/parts for the house parts list.; MPN: NCP15WB473F03RC; GateName_1: G$1; DeviceName: _0402; MF: Murata; POPULATE: 1; SymbolName_1: RESISTOR; LibraryName: mfpassives; DeviceSetName: RESISTOR; HOUSEPART: HOUSEPART; TOLERANCE: TOLERANCE; URL: URL; VOLTAGE: VOLTAGE; WATTAGE: WATTAGE
R18 R19 = RESISTOR_0402: Library:  MF_Passives Description: Device for Resistors. Manufacture part number (MPN), Voltage, Tolerance, and Wattage Rating can be added via Attributes.  Check https://factory.macrofab.com/parts for the house parts list.; MPN: RC0402FR-0710KL; GateName_1: G$1; DeviceName: _0402; MF: Yageo; POPULATE: 1; SymbolName_1: RESISTOR; LibraryName: mfpassives; DeviceSetName: RESISTOR; HOUSEPART: HOUSEPART; TOLERANCE: TOLERANCE; URL: URL; VOLTAGE: VOLTAGE; WATTAGE: WATTAGE
R20 R21 = RESISTOR_0402: Library:  MF_Passives Description: Device for Resistors. Manufacture part number (MPN), Voltage, Tolerance, and Wattage Rating can be added via Attributes.  Check https://factory.macrofab.com/parts for the house parts list.; HOUSEPART: 1; MPN: MF-RES-0402-560; GateName_1: G$1; DeviceName: _0402; SymbolName_1: RESISTOR; LibraryName: mfpassives; DeviceSetName: RESISTOR; POPULATE: 1; TOLERANCE: TOLERANCE; URL: URL; VOLTAGE: VOLTAGE; WATTAGE: WATTAGE
R22-R24 = RESISTOR_0402: Library:  MF_Passives Description: Device for Resistors. Manufacture part number (MPN), Voltage, Tolerance, and Wattage Rating can be added via Attributes.  Check https://factory.macrofab.com/parts for the house parts list.; HOUSEPART: 1; MPN: MF-RES-0402-22; GateName_1: G$1; DeviceName: _0402; SymbolName_1: RESISTOR; LibraryName: mfpassives; DeviceSetName: RESISTOR; POPULATE: 1; TOLERANCE: TOLERANCE; URL: URL; VOLTAGE: VOLTAGE; WATTAGE: WATTAGE
R27 R28 R30-R32 = RESISTOR_0402: Library:  MF_Passives Description: Device for Resistors. Manufacture part number (MPN), Voltage, Tolerance, and Wattage Rating can be added via Attributes.  Check https://factory.macrofab.com/parts for the house parts list.; HOUSEPART: 1; MPN: RC0402FR-077R5L; GateName_1: G$1; DeviceName: _0402; SymbolName_1: RESISTOR; LibraryName: mfpassives; DeviceSetName: RESISTOR; POPULATE: 1; TOLERANCE: TOLERANCE; URL: URL; VOLTAGE: VOLTAGE; WATTAGE: WATTAGE
R29 = RESISTOR_0805: Library:  MF_Passives Description: Device for Resistors. Manufacture part number (MPN), Voltage, Tolerance, and Wattage Rating can be added via Attributes.  Check https://factory.macrofab.com/parts for the house parts list.; MPN: RC0805FR-077R5L; GateName_1: G$1; DeviceName: _0805; MF: Yageo; POPULATE: 1; SymbolName_1: RESISTOR; LibraryName: mfpassives; DeviceSetName: RESISTOR; HOUSEPART: HOUSEPART; TOLERANCE: TOLERANCE; URL: URL; VOLTAGE: VOLTAGE; WATTAGE: WATTAGE
R35 R36 = RESISTOR_0402: Library:  MF_Passives Description: Device for Resistors. Manufacture part number (MPN), Voltage, Tolerance, and Wattage Rating can be added via Attributes.  Check https://factory.macrofab.com/parts for the house parts list.; HOUSEPART: 0; MPN: RC0402FR-07120RL; GateName_1: G$1; DeviceName: _0402; POPULATE: 1; SymbolName_1: RESISTOR; LibraryName: mfpassives; DeviceSetName: RESISTOR; TOLERANCE: TOLERANCE; URL: URL; VOLTAGE: VOLTAGE; WATTAGE: WATTAGE
R37 = RESISTOR_0805: Library:  MF_Passives Description: Device for Resistors. Manufacture part number (MPN), Voltage, Tolerance, and Wattage Rating can be added via Attributes.  Check https://factory.macrofab.com/parts for the house parts list.; GateName_1: G$1; DeviceName: _0805; POPULATE: 0; SymbolName_1: RESISTOR; LibraryName: mfpassives; DeviceSetName: RESISTOR; HOUSEPART: HOUSEPART; MPN: MPN; TOLERANCE: TOLERANCE; URL: URL; VOLTAGE: VOLTAGE; WATTAGE: WATTAGE
R38-R40 = RESISTOR_0402: Library:  MF_Passives Description: Device for Resistors. Manufacture part number (MPN), Voltage, Tolerance, and Wattage Rating can be added via Attributes.  Check https://factory.macrofab.com/parts for the house parts list.; MPN: MF-RES-0402-0; GateName_1: G$1; DeviceName: _0402; POPULATE: 1; SymbolName_1: RESISTOR; LibraryName: mfpassives; DeviceSetName: RESISTOR; HOUSEPART: HOUSEPART; MF: MF; TOLERANCE: TOLERANCE; URL: URL; VOLTAGE: VOLTAGE; WATTAGE: WATTAGE
RA RB RC = R-US_M1206: RESISTOR, American symbol; MPN: HCS1206FTL500; GateName_1: G$1; SymbolName_1: R-US; DeviceSetName: R-US_; MF: Stackpole Electronics; POPULATE: 1; DeviceName: M1206; LibraryName: rcl
SH1-SH3 = SHORTT5: Short between two nets; GateName_1: G$1; SymbolName_1: SHORT-H; DeviceName: T5; BOM: no; POPULATE: 0; LibraryName: shorts; DeviceSetName: SHORT
SH4 = SHORTMEDIUM: Short between two nets; GateName_1: G$1; SymbolName_1: SHORT-H; DeviceName: MEDIUM; POPULATE: 0; LibraryName: shorts; DeviceSetName: SHORT
SWD = JST-ZH6: MPN: S6B-ZR-SM4A-TF(LF)(SN); GateName_1: A; SymbolName_1: CON06; MF: JST; POPULATE: 1; LibraryName: controller; DeviceSetName: JST-ZH6
TEMP = 1X2: GateName_1: G$1; SymbolName_1: 1X2_HEADER; POPULATE: 0; LibraryName: headers_2mm; DeviceSetName: 1X2; 01: 01; 02: 02
U1 = MAX15062AATA+T: MANUFACTURER_PART_NUMBER: MAX15062BATA+T; GateName_1: A; BUILT_BY: EMA_Jessica; MF: Maxim; POPULATE: 1; SOURCELIBRARY: Maxim_DP_2018-06-12; VENDOR: Maxim Integrated Products; SymbolName_1: MAX15062AATA+T; LibraryName: power_dist; DeviceSetName: MAX15062AATA+T; COPYRIGHT: Copyright (C) 2018 Accelerated Designs. All rights reserved; MPN: MAX15062BATA+T; REVISION: 1
U2 = ADP5301ACBZ-4-R7: Switching Voltage Regulators ULP buck 3.3V w/o OD 2.8ms   Source:  Datasheet; MANUFACTURER_NAME: Analog Devices; GateName_1: G$1; POPULATE: 1; SymbolName_1: ADP5301ACBZ-4-R7; LibraryName: ADP5301ACBZ-4-R7; DeviceSetName: ADP5301ACBZ-4-R7; DESCRIPTION: Switching Voltage Regulators ULP buck 3.3V w/o OD 2.8ms; HEIGHT: 0.66mm; MANUFACTURER_PART_NUMBER: ADP5301ACBZ-4-R7; MOUSER_PART_NUMBER: 584-ADP5301ACBZ-4-R7; MOUSER_PRICE-STOCK: https://www.mouser.co.uk/ProductDetail/Analog-Devices/ADP5301ACBZ-4-R7?qs=P1JMDcb91o5nnuK7yeEdIw%3D%3D; MPN: ADP5301ACBZ-4-R7
U3 = STM32G474CEU6: STMICROELECTRONICS - STM32G474CEU6 - MCU, 32BIT, 170MHZ, UFQFPN-48   Source:  Datasheet; GateName_1: G$1; POPULATE: 1; SymbolName_1: STM32G474CEU6; LibraryName: controller; DeviceSetName: STM32G474CEU6; DESCRIPTION: STMICROELECTRONICS - STM32G474CEU6 - MCU, 32BIT, 170MHZ, UFQFPN-48; HEIGHT: 0.6mm; MANUFACTURER_NAME: STMicroelectronics; MANUFACTURER_PART_NUMBER: STM32G474CEU6; MOUSER_PART_NUMBER: 511-STM32G474CEU6; MOUSER_PRICE-STOCK: https://www.mouser.com/Search/Refine.aspx?Keyword=511-STM32G474CEU6; MPN: STM32G474CEU6
U4 = TCAN1042HGV: MPN: TCAN1057AEVDRQ1; GateName_1: G$1; MF: TI; POPULATE: 1; SymbolName_1: TCAN1042HGV; LibraryName: moteus_hp; DeviceSetName: TCAN1042HGV
U5 = AS5147: MPN: AS5047P-ATSM; GateName_1: G$1; MF: AMS; POPULATE: 1; SymbolName_1: AS5147; LibraryName: controller; DeviceSetName: AS5147; AS5147: AS5147
U7 = DRV8353S: MPN: DRV8353FSRTAR; GateName_1: G$1; MF: TI; POPULATE: 1; SymbolName_1: DRV8353S; LibraryName: moteus_hp; DeviceSetName: DRV8353S; DRV8353S: DRV8353S
U8 = SN65HVD35DR: MFR_NAME: Texas Instruments; GateName_1: A; SymbolName_1: SN65HVD35_D_14; LibraryName: moteus_hp; DeviceSetName: SN65HVD35DR; COPYRIGHT: Copyright (C) 2022 Ultra Librarian. All rights reserved.; DIGI-KEY_PART_NUMBER_1: 296-18706-1-ND; DIGI-KEY_PART_NUMBER_2: 296-18706-2-ND; DIGI-KEY_PART_NUMBER_3: 296-18706-6-ND; MANUFACTURER_PART_NUMBER: SN65HVD35DR